# EAGLE design UMN_HASP_2015_Photon_Preprocessor (EAGLE 7.3.0)

## Sheet 1 of 5: ATmega2560
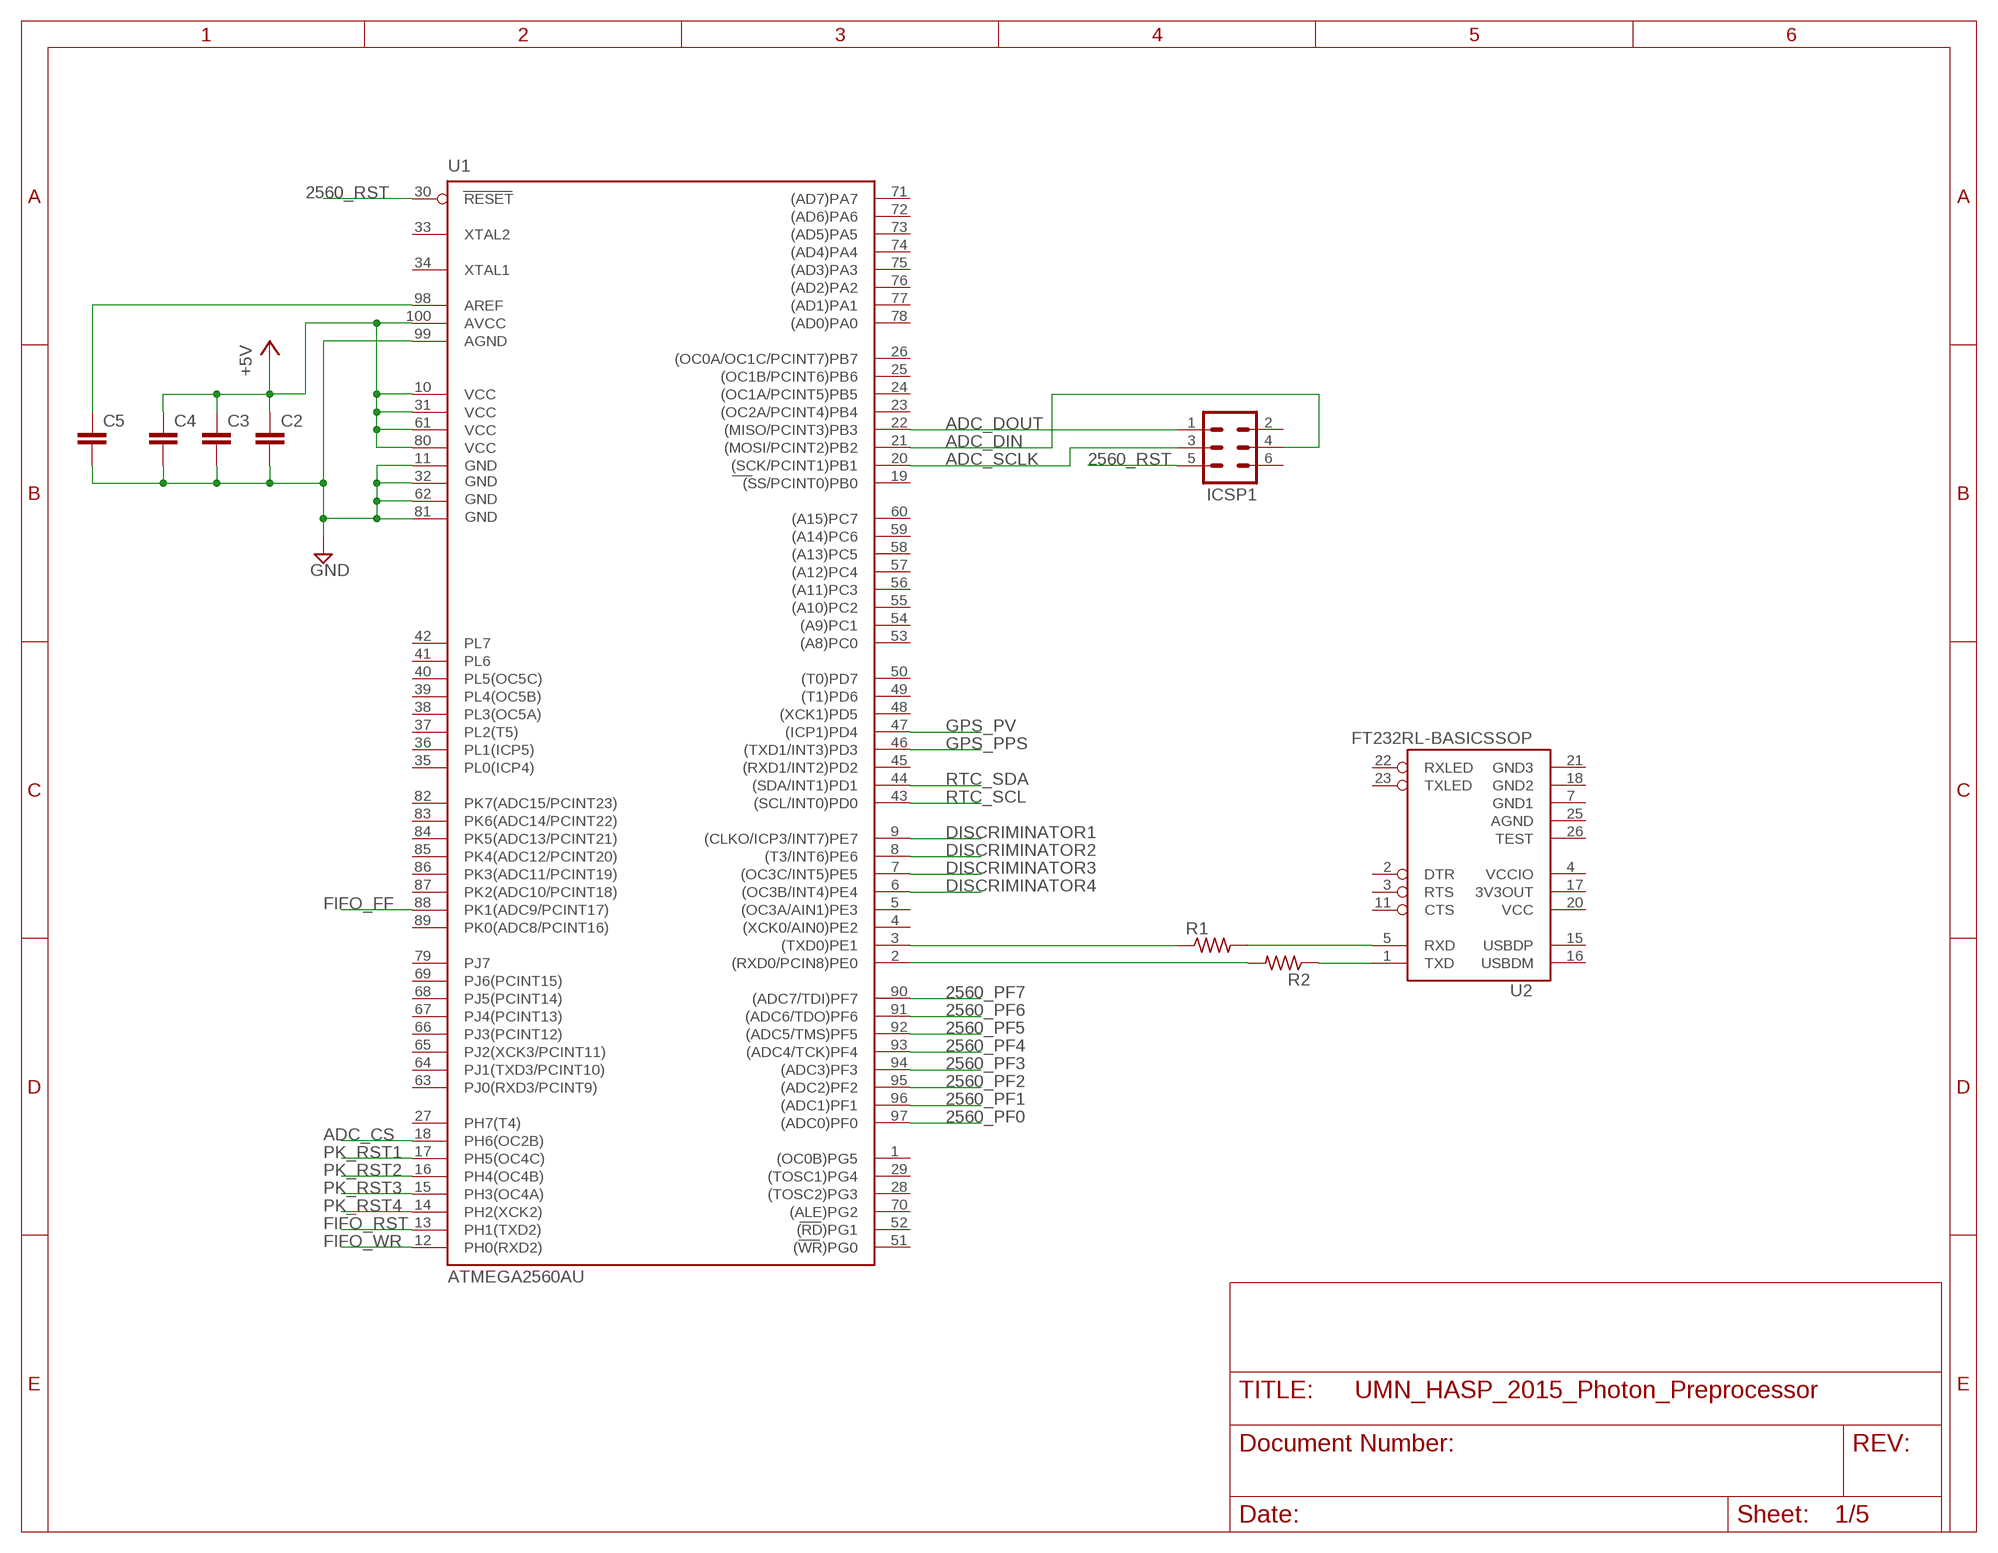
[diagram p0: schematic, sheet 1]

### Parts
C2  C-EUC0603K  [C0603K]
C3  C-EUC0603K  [C0603K]
C4  C-EUC0603K  [C0603K]
C5  C-EUC0603K  [C0603K]
ICSP1  MA03-2  [MA03-2]
R1  R-US_R0603  [R0603]
R2  R-US_R0603  [R0603]
U1  ATMEGA2560AU  [TQFP100]
U2  FT232RL-BASICSSOP  [SSOP28DB]

### Nets
2560_PF0: U1.97((ADC0)PF0) ; also sheet 4
2560_PF1: U1.96((ADC1)PF1) ; also sheet 4
2560_PF2: U1.95((ADC2)PF2) ; also sheet 4
2560_PF3: U1.94((ADC3)PF3) ; also sheet 4
2560_PF4: U1.93((ADC4/TCK)PF4) ; also sheet 4
2560_PF5: U1.92((ADC5/TMS)PF5) ; also sheet 4
2560_PF6: U1.91((ADC6/TDO)PF6) ; also sheet 4
2560_PF7: U1.90((ADC7/TDI)PF7) ; also sheet 4
2560_RST: ICSP1.5 U1.30(RESET)
+5V: C2.1 C3.1 C4.1 U1.10(VCC) U1.31(VCC1) U1.61(VCC2) U1.80(VCC3) U1.100(AVCC) ; also sheet 3,4,5
ADC_CS: U1.18(PH6(OC2B)) ; also sheet 5
ADC_DIN: ICSP1.4 U1.21((MOSI/PCINT2)PB2) ; also sheet 5
ADC_DOUT: ICSP1.1 U1.22((MISO/PCINT3)PB3) ; also sheet 5
ADC_SCLK: ICSP1.3 U1.20((SCK/PCINT1)PB1) ; also sheet 5
DISCRIMINATOR1: U1.9((CLKO/ICP3/INT7)PE7) ; also sheet 5
DISCRIMINATOR2: U1.8((T3/INT6)PE6) ; also sheet 5
DISCRIMINATOR3: U1.7((OC3C/INT5)PE5) ; also sheet 5
DISCRIMINATOR4: U1.6((OC3B/INT4)PE4) ; also sheet 5
FIFO_FF: U1.88(PK1(ADC9/PCINT17)) ; also sheet 4
FIFO_RST: U1.13(PH1(TXD2)) ; also sheet 4
FIFO_WR: U1.12(PH0(RXD2)) ; also sheet 4
GND: C2.2 C3.2 C4.2 C5.2 U1.11(GND) U1.32(GND1) U1.62(GND2) U1.81(GND3) U1.99(AGND) ; also sheet 3,4,5
GPS_PPS: U1.46((TXD1/INT3)PD3) ; also sheet 3
GPS_PV: U1.47((ICP1)PD4) ; also sheet 3
N$8: R2.1 U2.1(TXD)
N$9: R1.2 U2.5(RXD)
N$16: C5.1 U1.98(AREF)
N$18: R2.2 U1.2((RXD0/PCIN8)PE0)
N$19: R1.1 U1.3((TXD0)PE1)
PK_RST1: U1.17(PH5(OC4C)) ; also sheet 5
PK_RST2: U1.16(PH4(OC4B)) ; also sheet 5
PK_RST3: U1.15(PH3(OC4A)) ; also sheet 5
PK_RST4: U1.14(PH2(XCK2)) ; also sheet 5
RTC_SCL: U1.43((SCL/INT0)PD0) ; also sheet 3
RTC_SDA: U1.44((SDA/INT1)PD1) ; also sheet 3
Unconnected: ICSP1.2 ICSP1.6 U1.1((OC0B)PG5) U1.4((XCK0/AIN0)PE2) U1.5((OC3A/AIN1)PE3) U1.19((SS/PCINT0)PB0) U1.23((OC2A/PCINT4)PB4) U1.24((OC1A/PCINT5)PB5) U1.25((OC1B/PCINT6)PB6) U1.26((OC0A/OC1C/PCINT7)PB7) U1.27(PH7(T4)) U1.28((TOSC2)PG3) U1.29((TOSC1)PG4) U1.33(XTAL2) U1.34(XTAL1) U1.35(PL0(ICP4)) U1.36(PL1(ICP5)) U1.37(PL2(T5)) U1.38(PL3(OC5A)) U1.39(PL4(OC5B)) U1.40(PL5(OC5C)) U1.41(PL6) U1.42(PL7) U1.45((RXD1/INT2)PD2) U1.48((XCK1)PD5) U1.49((T1)PD6) U1.50((T0)PD7) U1.51((WR)PG0) U1.52((RD)PG1) U1.53((A8)PC0) U1.54((A9)PC1) U1.55((A10)PC2) U1.56((A11)PC3) U1.57((A12)PC4) U1.58((A13)PC5) U1.59((A14)PC6) U1.60((A15)PC7) U1.63(PJ0(RXD3/PCINT9)) U1.64(PJ1(TXD3/PCINT10)) U1.65(PJ2(XCK3/PCINT11)) U1.66(PJ3(PCINT12)) U1.67(PJ4(PCINT13)) U1.68(PJ5(PCINT14)) U1.69(PJ6(PCINT15)) U1.70((ALE)PG2) U1.71((AD7)PA7) U1.72((AD6)PA6) U1.73((AD5)PA5) U1.74((AD4)PA4) U1.75((AD3)PA3) U1.76((AD2)PA2) U1.77((AD1)PA1) U1.78((AD0)PA0) U1.79(PJ7) U1.82(PK7(ADC15/PCINT23)) U1.83(PK6(ADC14/PCINT22)) U1.84(PK5(ADC13/PCINT21)) U1.85(PK4(ADC12/PCINT20)) U1.86(PK3(ADC11/PCINT19)) U1.87(PK2(ADC10/PCINT18)) U1.89(PK0(ADC8/PCINT16)) U2.2(DTR) U2.3(RTS) U2.11(CTS) U2.15(USBDP) U2.16(USBDM) U2.17(3V3OUT) U2.22(RXLED) U2.23(TXLED) U2.26(TEST)

## Sheet 2 of 5: ATmega32u4
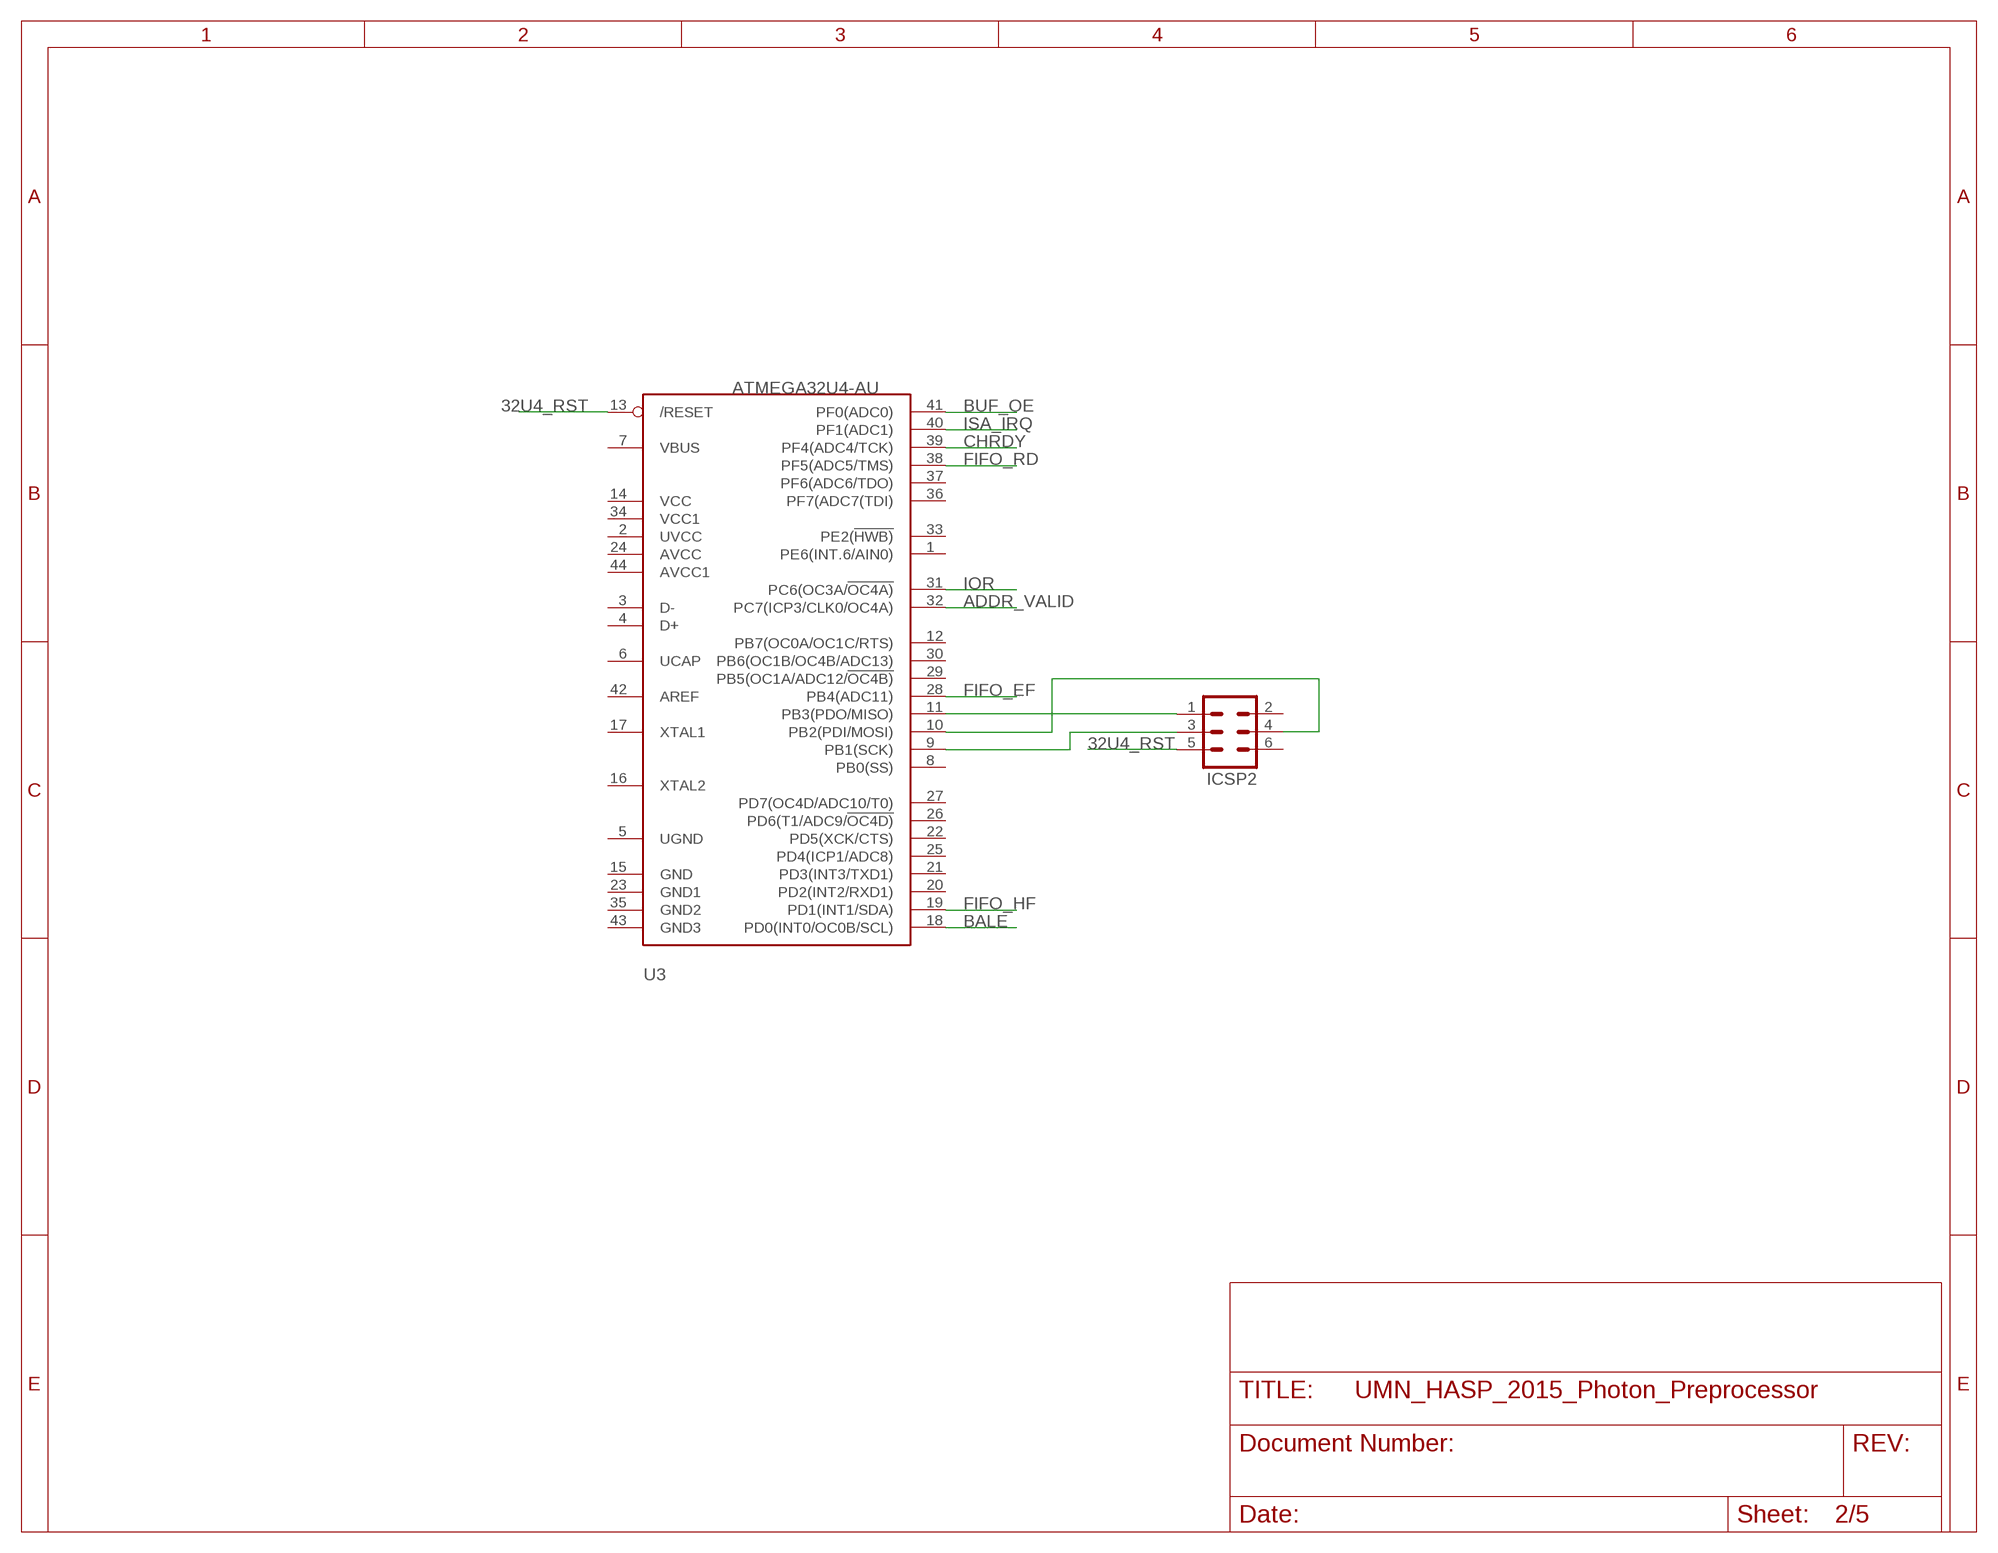
[diagram p1: schematic, sheet 2]

### Parts
ICSP2  MA03-2  [MA03-2]
U3  ATMEGA32U4-AU  [TQFP44]

### Nets
32U4_RST: ICSP2.5 U3.13(/RESET)
ADDR_VALID: U3.32(PC7(ICP3/CLK0/OC4A)) ; also sheet 4
BALE: U3.18(PD0(INT0/OC0B/SCL)) ; also sheet 5
BUF_OE: U3.41(PF0(ADC0)) ; also sheet 4
CHRDY: U3.39(PF4(ADC4/TCK)) ; also sheet 4
FIFO_EF: U3.28(PB4(ADC11)) ; also sheet 4
FIFO_HF: U3.19(PD1(INT1/SDA)) ; also sheet 4
FIFO_RD: U3.38(PF5(ADC5/TMS)) ; also sheet 4
IOR: U3.31(PC6(OC3A/!OC4A)) ; also sheet 5
ISA_IRQ: U3.40(PF1(ADC1)) ; also sheet 4
N$10: ICSP2.1 U3.11(PB3(PDO/MISO))
N$15: ICSP2.3 U3.9(PB1(SCK))
N$17: ICSP2.4 U3.10(PB2(PDI/MOSI))
Unconnected: ICSP2.2 ICSP2.6 U3.1(PE6(INT.6/AIN0)) U3.2(UVCC) U3.3(D-) U3.4(D+) U3.5(UGND) U3.6(UCAP) U3.7(VBUS) U3.8(PB0(SS)) U3.12(PB7(OC0A/OC1C/RTS)) U3.14(VCC) U3.15(GND) U3.16(XTAL2) U3.17(XTAL1) U3.20(PD2(INT2/RXD1)) U3.21(PD3(INT3/TXD1)) U3.22(PD5(XCK/CTS)) U3.23(GND1) U3.24(AVCC) U3.25(PD4(ICP1/ADC8)) U3.26(PD6(T1/ADC9/!OC4D)) U3.27(PD7(OC4D/ADC10/T0)) U3.29(PB5(OC1A/ADC12/!OC4B)) U3.30(PB6(OC1B/OC4B/ADC13)) U3.33(PE2(!HWB)) U3.34(VCC1) U3.35(GND2) U3.36(PF7(ADC7(TDI)) U3.37(PF6(ADC6/TDO)) U3.42(AREF) U3.43(GND3) U3.44(AVCC1)

## Sheet 3 of 5: Timing
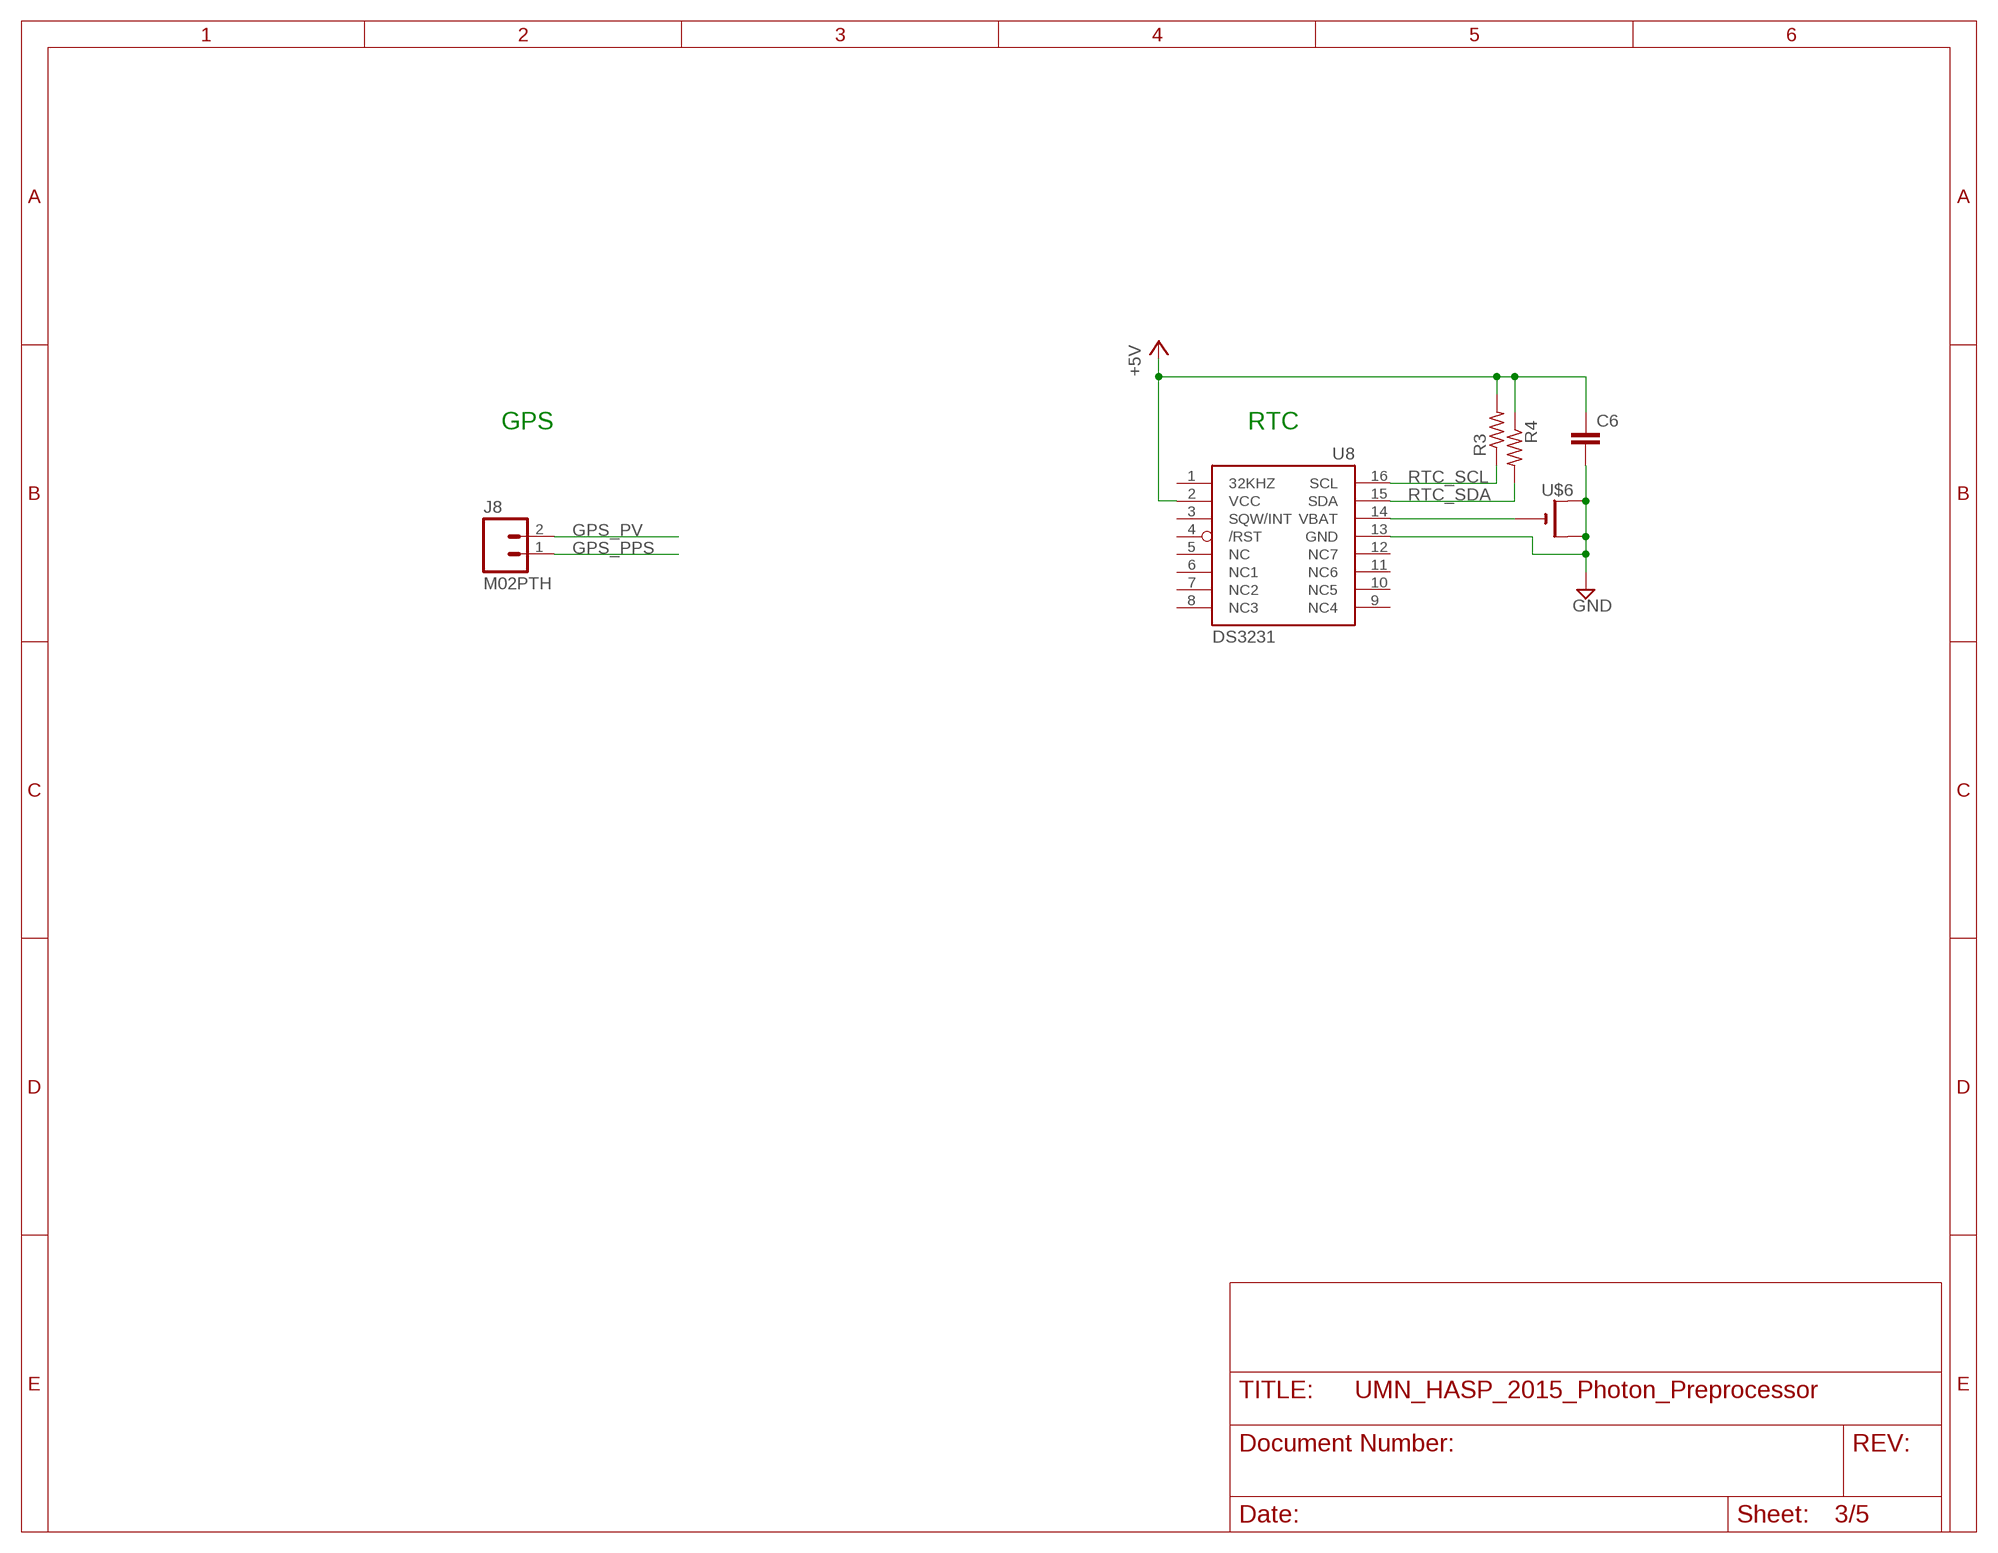
[diagram p2: schematic, sheet 3]

### Parts
C6  C-EUC0603K  [C0603K]
J8  M02PTH  [1X02]
R3  R-US_R0603  [R0603]
R4  R-US_R0603  [R0603]
U8  DS3231/SO  [SO16W]
U$6  CR1220SMT  [CR1220-SMD]

### Nets
+5V: C6.1 R3.2 R4.1 U8.2(VCC) ; also sheet 1,4,5
GND: C6.2 U8.13(GND) U$6.+$1(+) U$6.+$2(+1) ; also sheet 1,4,5
GPS_PPS: J8.1 ; also sheet 1
GPS_PV: J8.2 ; also sheet 1
N$24: U8.14(VBAT) U$6.-
RTC_SCL: R3.1 U8.16(SCL) ; also sheet 1
RTC_SDA: R4.2 U8.15(SDA) ; also sheet 1
Unconnected: U8.1(32KHZ) U8.3(SQW/INT) U8.4(/RST) U8.5(NC) U8.6(NC1) U8.7(NC2) U8.8(NC3) U8.9(NC4) U8.10(NC5) U8.11(NC6) U8.12(NC7)

### Notes on the sheet
- GPS | RTC

## Sheet 4 of 5: Logic
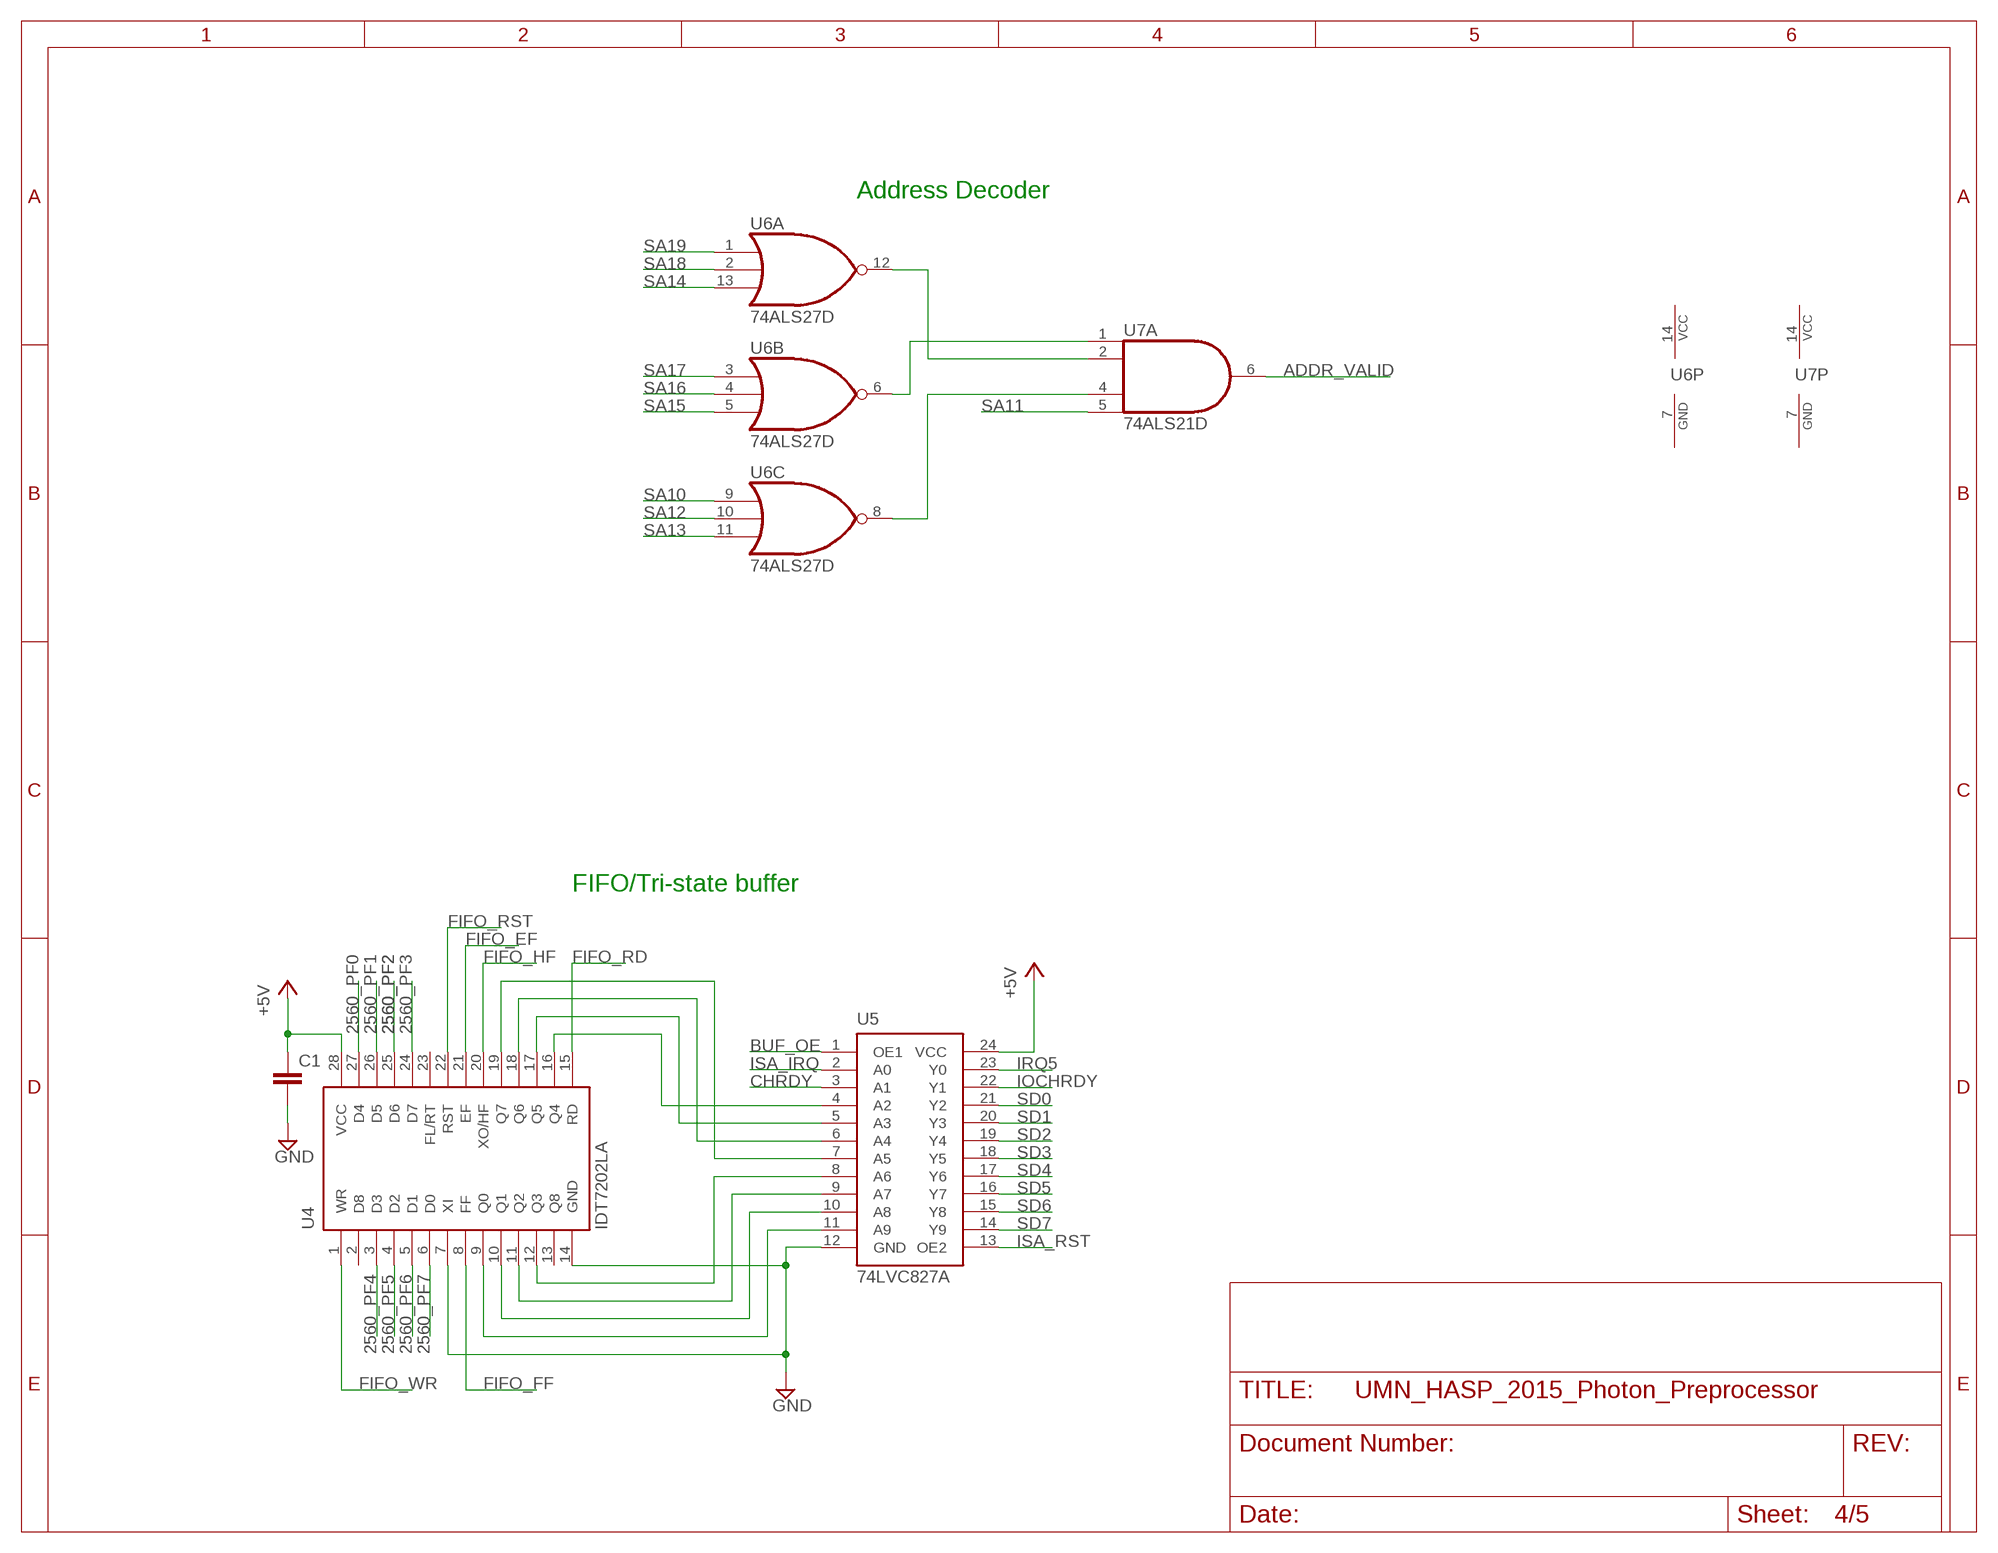
[diagram p3: schematic, sheet 4]

### Parts
C1  C-EUC0603K  [C0603K]
U4  IDT7202LA  [SO28W]
U5  74LVC827A  [SO24W]
U6  74ALS27D  [SO14]
U7  74ALS21D  [SO14]

### Nets
2560_PF0: U4.27(D4) ; also sheet 1
2560_PF1: U4.26(D5) ; also sheet 1
2560_PF2: U4.25(D6) ; also sheet 1
2560_PF3: U4.24(D7) ; also sheet 1
2560_PF4: U4.3(D3) ; also sheet 1
2560_PF5: U4.4(D2) ; also sheet 1
2560_PF6: U4.5(D1) ; also sheet 1
2560_PF7: U4.6(D0) ; also sheet 1
+5V: C1.1 U4.28(VCC) U5.24(VCC) ; also sheet 1,3,5
ADDR_VALID: U7.6(A:O) ; also sheet 2
BUF_OE: U5.1(OE1) ; also sheet 2
CHRDY: U5.3(A1) ; also sheet 2
FIFO_EF: U4.21(EF) ; also sheet 2
FIFO_FF: U4.8(FF) ; also sheet 1
FIFO_HF: U4.20(XO/HF) ; also sheet 2
FIFO_RD: U4.15(RD) ; also sheet 2
FIFO_RST: U4.22(RST) ; also sheet 1
FIFO_WR: U4.1(WR) ; also sheet 1
GND: C1.2 U4.7(XI) U4.14(GND) U5.12(GND) ; also sheet 1,3,5
IOCHRDY: U5.22(Y1) ; also sheet 5
IRQ5: U5.23(Y0) ; also sheet 5
ISA_IRQ: U5.2(A0) ; also sheet 2
ISA_RST: U5.13(OE2) ; also sheet 5
N$1: U6.12(A:O) U7.2(A:I1)
N$2: U6.6(B:O) U7.1(A:I0)
N$3: U6.8(C:O) U7.4(A:I2)
N$4: U4.12(Q3) U5.8(A6)
N$5: U4.11(Q2) U5.9(A7)
N$6: U4.10(Q1) U5.10(A8)
N$7: U4.9(Q0) U5.11(A9)
N$11: U4.16(Q4) U5.4(A2)
N$12: U4.19(Q7) U5.7(A5)
N$13: U4.18(Q6) U5.6(A4)
N$14: U4.17(Q5) U5.5(A3)
SA10: U6.9(C:I0) ; also sheet 5
SA11: U7.5(A:I3) ; also sheet 5
SA12: U6.10(C:I1) ; also sheet 5
SA13: U6.11(C:I2) ; also sheet 5
SA14: U6.13(A:I2) ; also sheet 5
SA15: U6.5(B:I2) ; also sheet 5
SA16: U6.4(B:I1) ; also sheet 5
SA17: U6.3(B:I0) ; also sheet 5
SA18: U6.2(A:I1) ; also sheet 5
SA19: U6.1(A:I0) ; also sheet 5
SD0: U5.21(Y2) ; also sheet 5
SD1: U5.20(Y3) ; also sheet 5
SD2: U5.19(Y4) ; also sheet 5
SD3: U5.18(Y5) ; also sheet 5
SD4: U5.17(Y6) ; also sheet 5
SD5: U5.16(Y7) ; also sheet 5
SD6: U5.15(Y8) ; also sheet 5
SD7: U5.14(Y9) ; also sheet 5
Unconnected: U4.2(D8) U4.13(Q8) U4.23(FL/RT) U7.8(B:O) U7.9(B:I0) U7.10(B:I1) U7.12(B:I2) U7.13(B:I3)

### Notes on the sheet
- Address Decoder
- FIFO/Tri-state buffer

## Sheet 5 of 5: PC/104
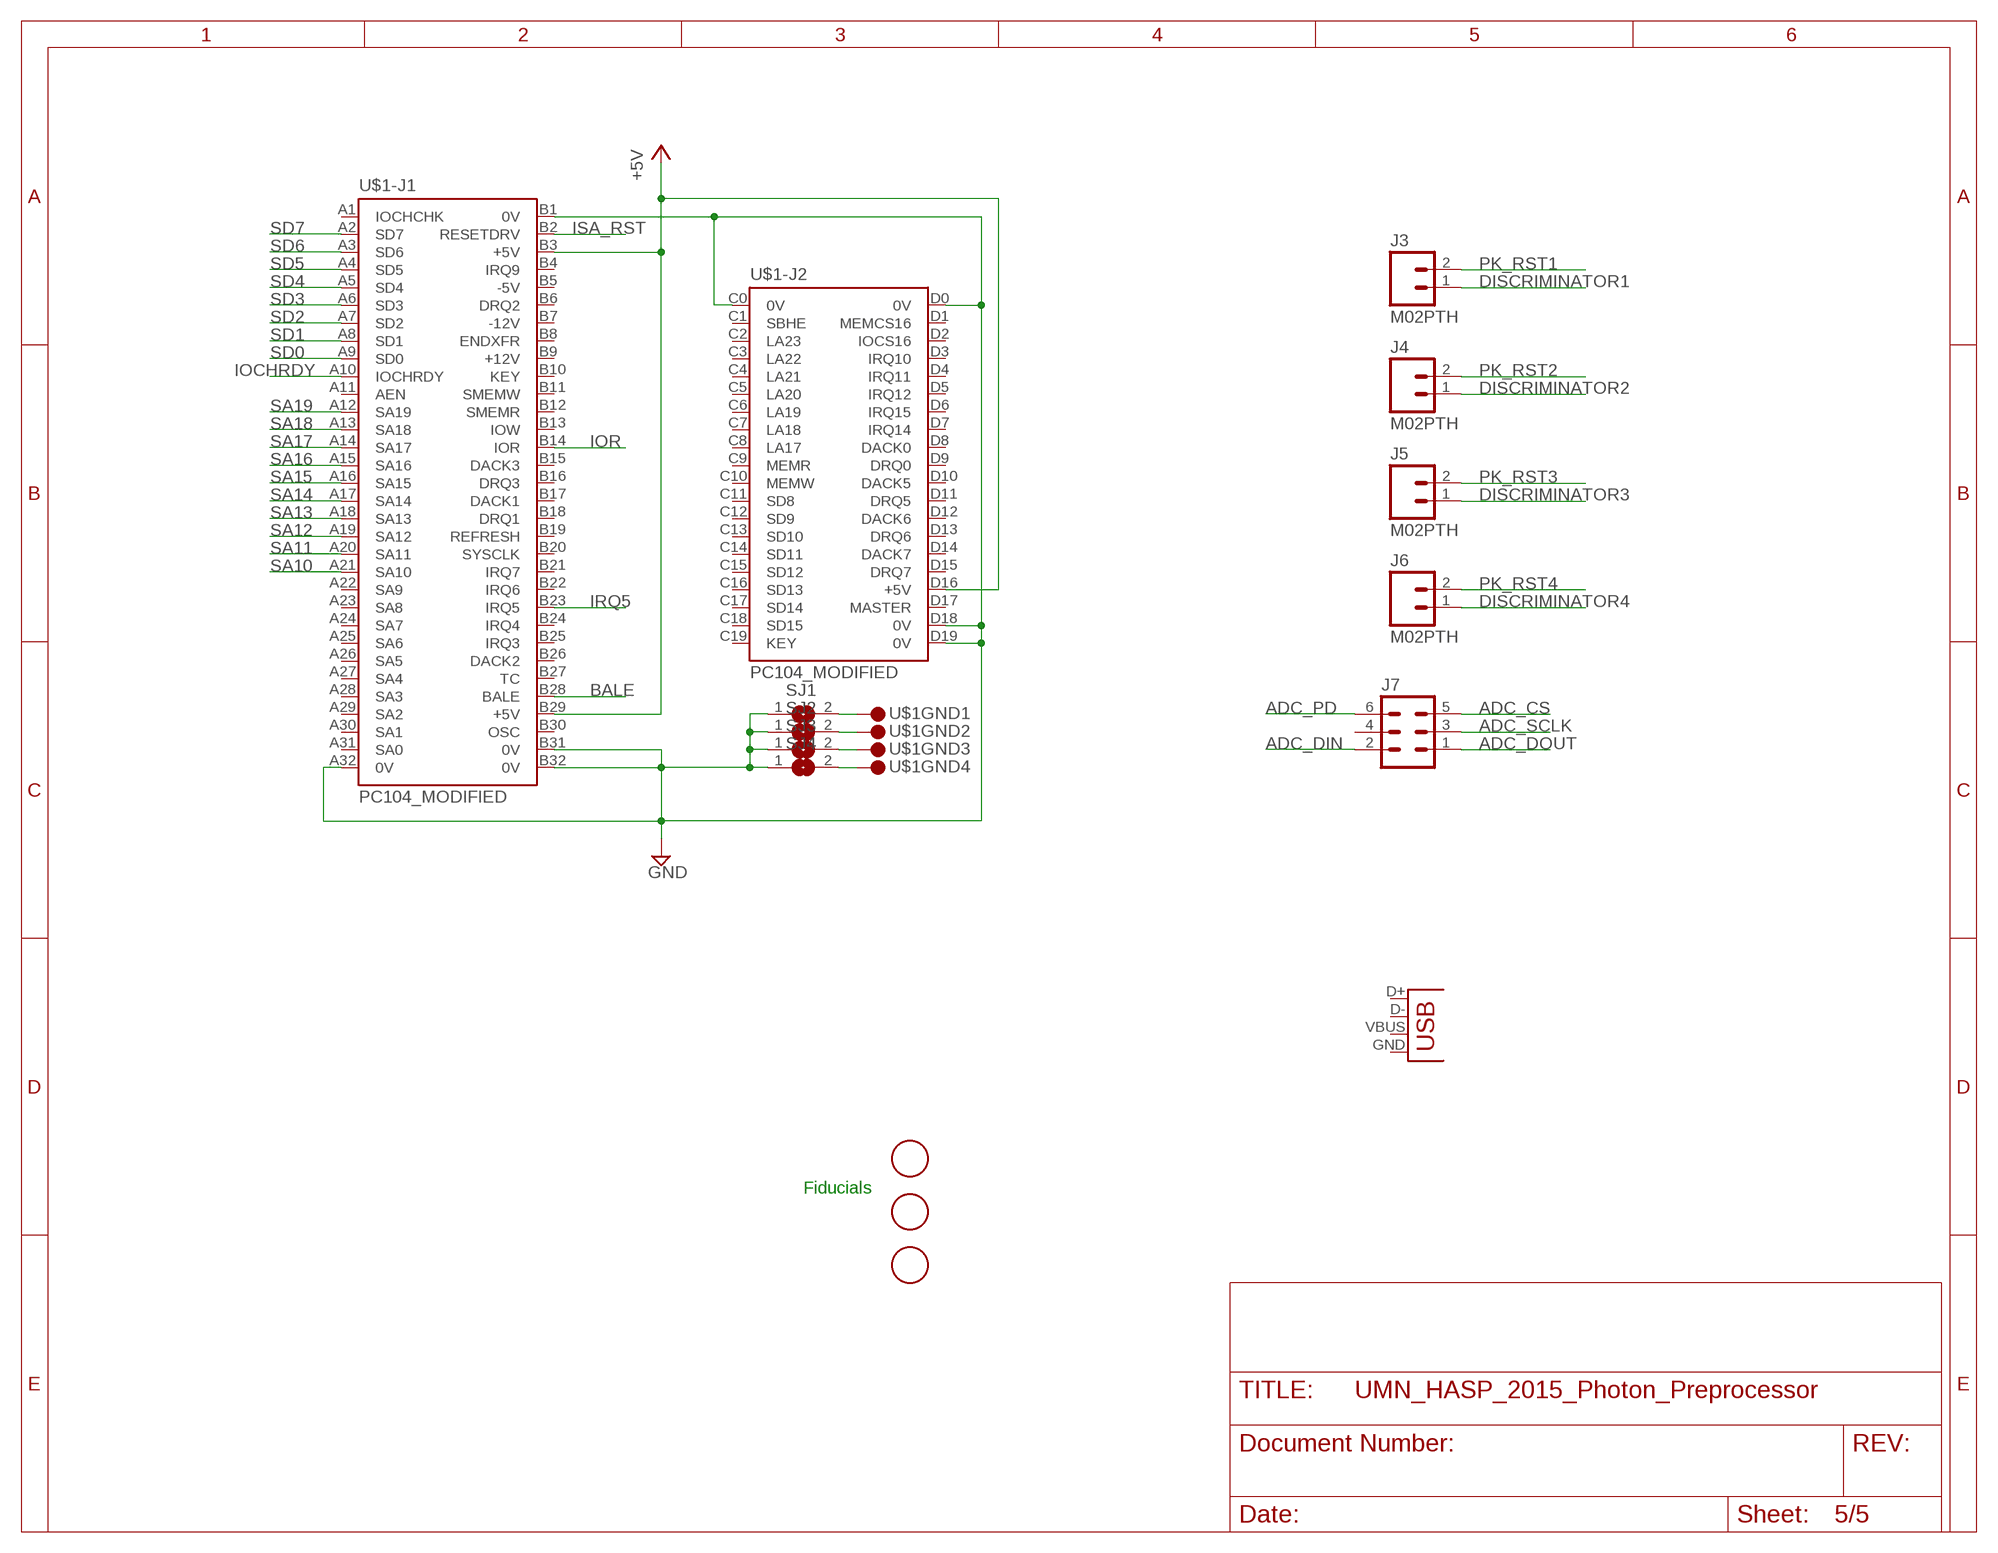
[diagram p4: schematic, sheet 5]

### Parts
J3  M02PTH  [1X02]
J4  M02PTH  [1X02]
J5  M02PTH  [1X02]
J6  M02PTH  [1X02]
J7  MA03-2  [MA03-2]
JP5  USB-B  USBPTH  [USB-B-PTH]
SJ1  SJ  [SJ]
SJ2  SJ  [SJ]
SJ3  SJ  [SJ]
SJ4  SJ  [SJ]
U$1  PC104_MODIFIED  [PC104_MODIFIED]
U$2  FIDUCIAL  [FIDUCIAL_1MM]
U$3  FIDUCIAL  [FIDUCIAL_1MM]
U$4  FIDUCIAL  [FIDUCIAL_1MM]

### Nets
+5V: U$1.B3(-J1:+5V) U$1.B29(-J1:+5V) U$1.D16(-J2:+5V) ; also sheet 1,3,4
ADC_CS: J7.5 ; also sheet 1
ADC_DIN: J7.2 ; also sheet 1
ADC_DOUT: J7.1 ; also sheet 1
ADC_PD: J7.6
ADC_SCLK: J7.3 ; also sheet 1
BALE: U$1.B28(-J1:BALE) ; also sheet 2
DISCRIMINATOR1: J3.1 ; also sheet 1
DISCRIMINATOR2: J4.1 ; also sheet 1
DISCRIMINATOR3: J5.1 ; also sheet 1
DISCRIMINATOR4: J6.1 ; also sheet 1
GND: SJ1.1 SJ2.1 SJ3.1 SJ4.1 U$1.A32(-J1:0V) U$1.B1(-J1:0V) U$1.B31(-J1:0V) U$1.B32(-J1:0V) U$1.C0(-J2:0V) U$1.D0(-J2:0V) U$1.D18(-J2:0V) U$1.D19(-J2:0V) ; also sheet 1,3,4
IOCHRDY: U$1.A10(-J1:IOCHRDY) ; also sheet 4
IOR: U$1.B14(-J1:IOR) ; also sheet 2
IRQ5: U$1.B23(-J1:IRQ5) ; also sheet 4
ISA_RST: U$1.B2(-J1:RESETDRV) ; also sheet 4
N$20: SJ1.2 U$1.GND@1
N$21: SJ2.2 U$1.GND@2
N$22: SJ3.2 U$1.GND@3
N$23: SJ4.2 U$1.GND@4
PK_RST1: J3.2 ; also sheet 1
PK_RST2: J4.2 ; also sheet 1
PK_RST3: J5.2 ; also sheet 1
PK_RST4: J6.2 ; also sheet 1
SA10: U$1.A21(-J1:SA10) ; also sheet 4
SA11: U$1.A20(-J1:SA11) ; also sheet 4
SA12: U$1.A19(-J1:SA12) ; also sheet 4
SA13: U$1.A18(-J1:SA13) ; also sheet 4
SA14: U$1.A17(-J1:SA14) ; also sheet 4
SA15: U$1.A16(-J1:SA15) ; also sheet 4
SA16: U$1.A15(-J1:SA16) ; also sheet 4
SA17: U$1.A14(-J1:SA17) ; also sheet 4
SA18: U$1.A13(-J1:SA18) ; also sheet 4
SA19: U$1.A12(-J1:SA19) ; also sheet 4
SD0: U$1.A9(-J1:SD0) ; also sheet 4
SD1: U$1.A8(-J1:SD1) ; also sheet 4
SD2: U$1.A7(-J1:SD2) ; also sheet 4
SD3: U$1.A6(-J1:SD3) ; also sheet 4
SD4: U$1.A5(-J1:SD4) ; also sheet 4
SD5: U$1.A4(-J1:SD5) ; also sheet 4
SD6: U$1.A3(-J1:SD6) ; also sheet 4
SD7: U$1.A2(-J1:SD7) ; also sheet 4
Unconnected: J7.4 JP5.D+ JP5.D- JP5.GND JP5.VBUS U$1.A1(-J1:IOCHCHK) U$1.A11(-J1:AEN) U$1.A22(-J1:SA9) U$1.A23(-J1:SA8) U$1.A24(-J1:SA7) U$1.A25(-J1:SA6) U$1.A26(-J1:SA5) U$1.A27(-J1:SA4) U$1.A28(-J1:SA3) U$1.A29(-J1:SA2) U$1.A30(-J1:SA1) U$1.A31(-J1:SA0) U$1.B4(-J1:IRQ9) U$1.B5(-J1:-5V) U$1.B6(-J1:DRQ2) U$1.B7(-J1:-12V) U$1.B8(-J1:ENDXFR) U$1.B9(-J1:+12V) U$1.B10(-J1:KEY) U$1.B11(-J1:SMEMW) U$1.B12(-J1:SMEMR) U$1.B13(-J1:IOW) U$1.B15(-J1:DACK3) U$1.B16(-J1:DRQ3) U$1.B17(-J1:DACK1) U$1.B18(-J1:DRQ1) U$1.B19(-J1:REFRESH) U$1.B20(-J1:SYSCLK) U$1.B21(-J1:IRQ7) U$1.B22(-J1:IRQ6) U$1.B24(-J1:IRQ4) U$1.B25(-J1:IRQ3) U$1.B26(-J1:DACK2) U$1.B27(-J1:TC) U$1.B30(-J1:OSC) U$1.C1(-J2:SBHE) U$1.C2(-J2:LA23) U$1.C3(-J2:LA22) U$1.C4(-J2:LA21) U$1.C5(-J2:LA20) U$1.C6(-J2:LA19) U$1.C7(-J2:LA18) U$1.C8(-J2:LA17) U$1.C9(-J2:MEMR) U$1.C10(-J2:MEMW) U$1.C11(-J2:SD8) U$1.C12(-J2:SD9) U$1.C13(-J2:SD10) U$1.C14(-J2:SD11) U$1.C15(-J2:SD12) U$1.C16(-J2:SD13) U$1.C17(-J2:SD14) U$1.C18(-J2:SD15) U$1.C19(-J2:KEY) U$1.D1(-J2:MEMCS16) U$1.D2(-J2:IOCS16) U$1.D3(-J2:IRQ10) U$1.D4(-J2:IRQ11) U$1.D5(-J2:IRQ12) U$1.D6(-J2:IRQ15) U$1.D7(-J2:IRQ14) U$1.D8(-J2:DACK0) U$1.D9(-J2:DRQ0) U$1.D10(-J2:DACK5) U$1.D11(-J2:DRQ5) U$1.D12(-J2:DACK6) U$1.D13(-J2:DRQ6) U$1.D14(-J2:DACK7) U$1.D15(-J2:DRQ7) U$1.D17(-J2:MASTER)

### Notes on the sheet
- Fiducials

## Power pins joined to a net without a drawn wire
AGND: U2.25(AGND)
GND: U6.7(P:GND) U7.7(P:GND)
GND1: U2.7(GND1)
GND2: U2.18(GND2)
GND3: U2.21(GND3)
VCC: U2.20(VCC) U6.14(P:VCC) U7.14(P:VCC)
VCCIO: U2.4(VCCIO)

## Library data of the parts
C1-C6 = resistor:C-EU: CAPACITOR, European symbol
ICSP1 ICSP2 J7 = con-lstb:MA03-2: PIN HEADER; OC_FARNELL: unknown; OC_NEWARK: unknown
J3-J6 J8 = SparkFun-Connectors:M02: Standard 2-pin 0.1" header. Use with - straight break away headers ( PRT-00116) - right angle break away headers (PRT-00553) - swiss pins (PRT-00743) - machine pins (PRT-00117) - female headers (PRT-00115) Molex polarized connector foot print use with: PRT-08233 with associated crimp pins and housings. 2.54_SCREWTERM for use with PRT-10571. 3.5mm Screw Terminal footprints for PRT-08084 5mm Screw Terminal footprints for use with PRT-08433
JP5 = SparkFun-Connectors:USB: USB Connectors USB-B-PTH is fully proven SKU : PRT-00139/CONN-08278 USB-miniB is fully proven SKU : PRT-00587 USB-A-PCB is untested. USB-A-H is throughly reviewed, but untested. Spark Fun Electronics SKU : PRT-00437 USB-B-SMT is throughly reviewed, but untested. Needs silkscreen touching up. USB-A-S has not been used/tested USB-MB-H has not been used/tested USB-MICROB has been used. CONN-09505; PROD_ID: CONN-08278
R1-R4 = resistor:R-US_: RESISTOR, American symbol
SJ1-SJ4 = jumper:SJ: SMD solder JUMPER
U1 = SparkFun-DigitalIC:ATMEGA2560: Atmel 100-pin 8-bit uC 64/128/256 Kbytes FLASH 4 Kbytes EEPROM 8 Kbytes SRAM 86 General Purpose I/O pins 12-channels16-bit PWM 4 x Serial USARTs 16-channels 10-bit A/D
U2 = SparkFun-DigitalIC:FT232RL-BASIC: USB UART This is the simplified version of the FT232RL unit. Only what you need, nothing you don't. Spark Fun Electronics SKU : COM-00650
U3 = adafruit:ATMEGA32U4: http://www.ladyada.net/library/eagle
U4 = HAXDT_CUSTOM:IDT7202LA: IDT 1k x 9 asynchronous FIFO
U5 = HAXDT_CUSTOM:74LVC827A: NXP 10-bit tri-state buffer/line driver
U6 = 74xx-us:74*27: Triple 3-input NOR gate
U7 = 74xx-us:74*21: Dual 4-input AND gate
U8 = adafruit:DS3231
U$1 = con-pc104:PC104_MODIFIED
U$2-U$4 = adafruit:FIDUCIAL: For use by pick and place machines to calibrate the vision/machine, 1mm By microbuilder.eu
U$6 = adafruit:CR1220: CR1216/CR1220/CR1225 12mm 3V lithium coin cell Great for battery packup. Both SMT and THM holders. Note the THM package has the ground pads on both sides of the PCB so that the masks are the same - this reduces the cost

## Board
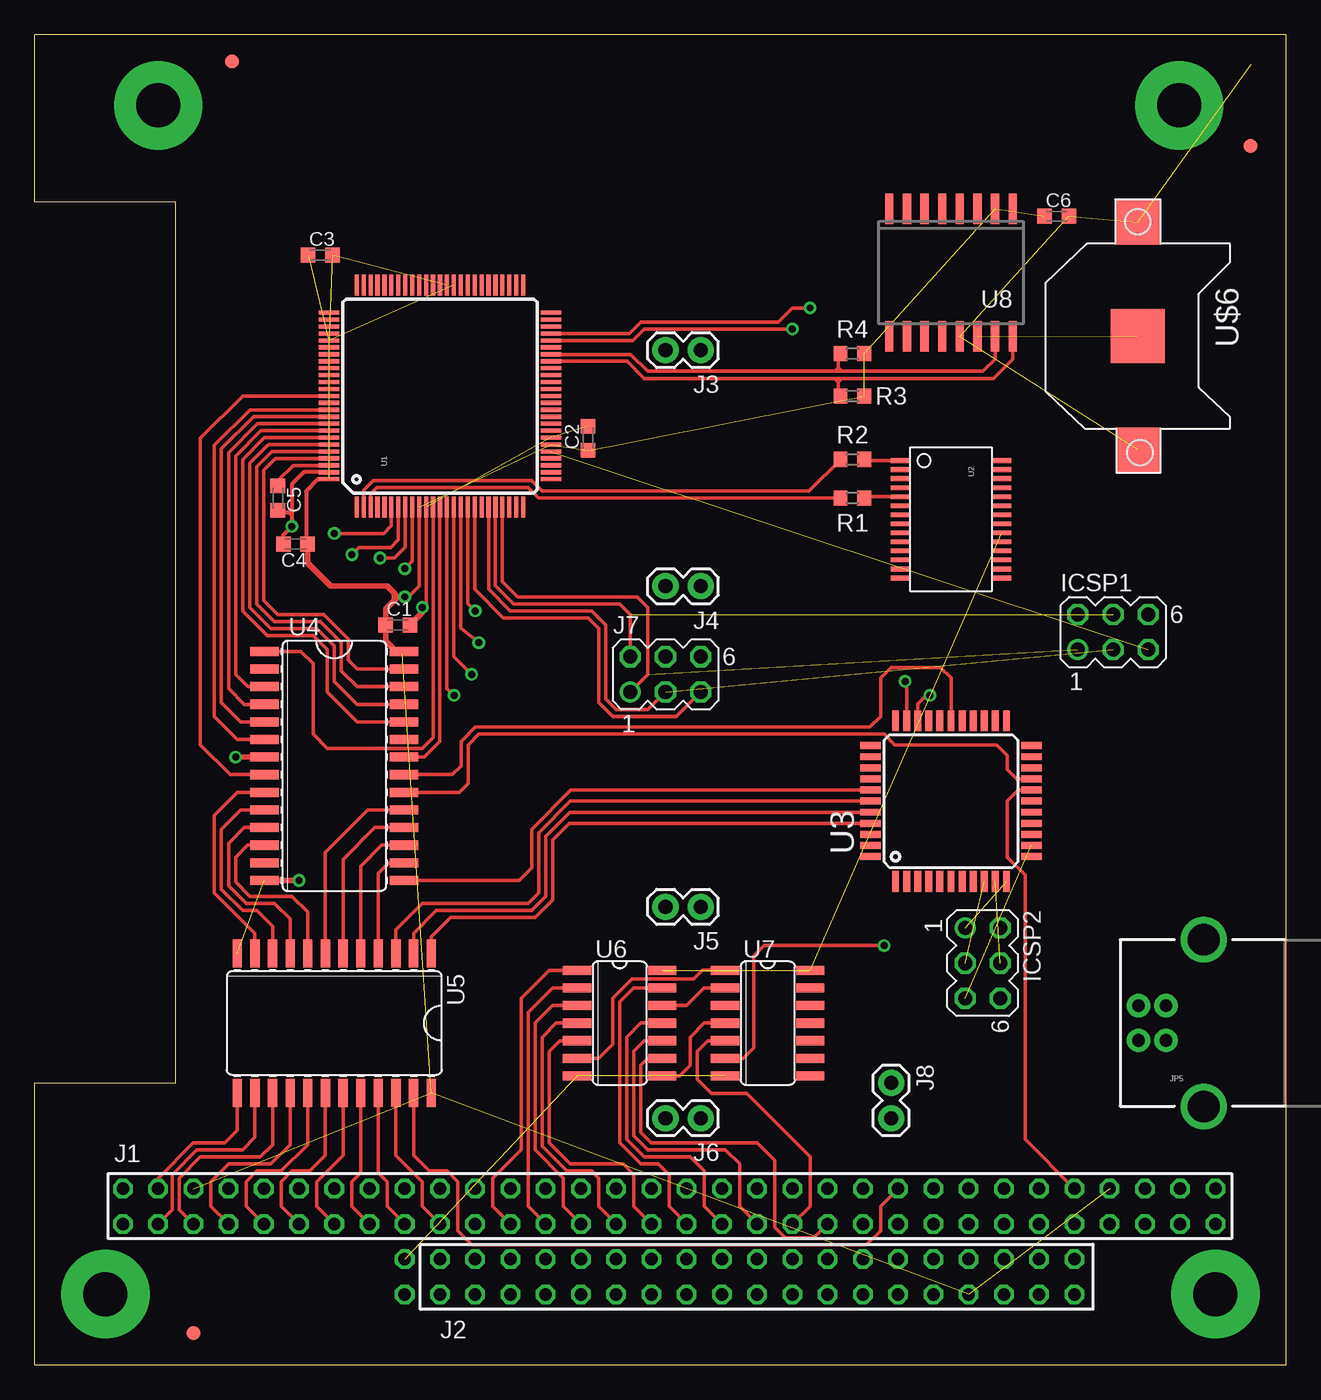
[diagram p5: board, top side]
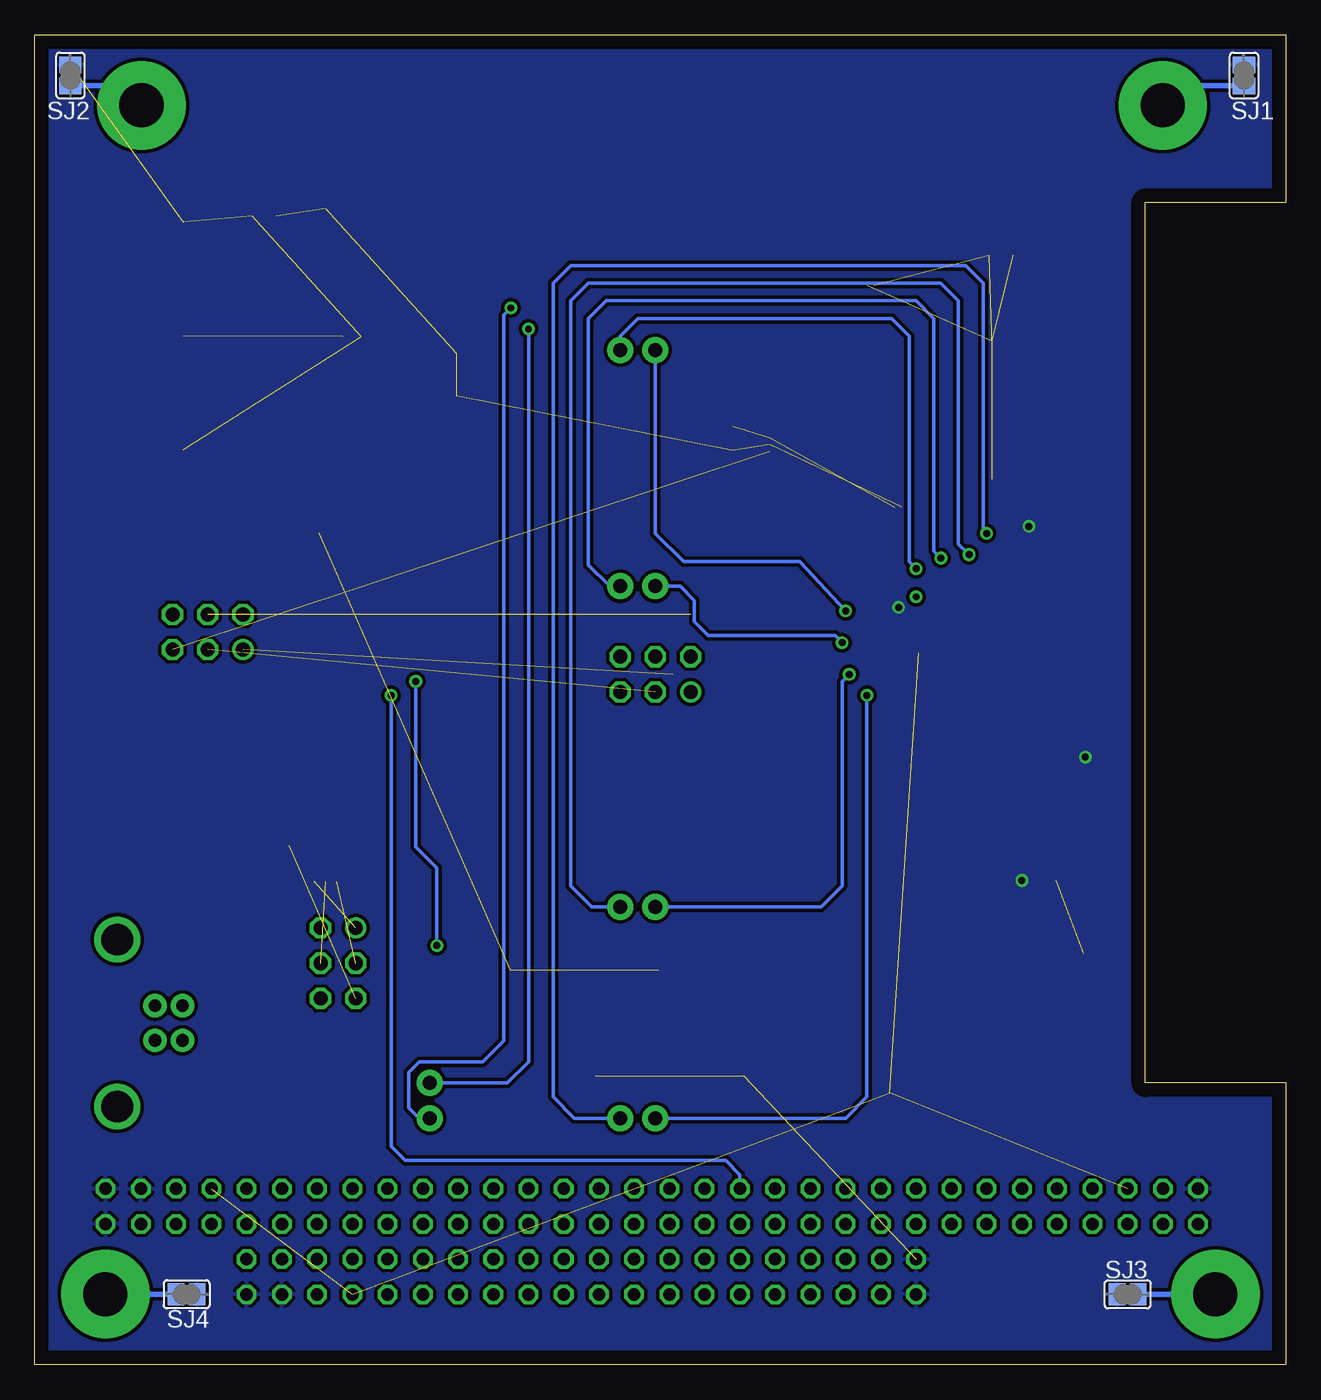
[diagram p6: board, bottom side, seen from below]

Size 90.2 x 95.9 mm. Coordinates in mm from the lower left corner, seen from the top.
Copper layers (1*16): Top 0.035mm / dielectric 1.5mm / Bottom 0.035mm
Design rules "default": minimum track width 10mil, minimum drill 24mil, track to track 8mil, track to pad 8mil, pad to pad 8mil, via to via 8mil, smd to smd 8mil, copper to edge 40mil, drill to drill 8mil, minimum pad ring 10mil, minimum via ring 8mil, stop-mask expansion 4mil, vias tented up to drill 0mil, thermal gap 10mil

### Footprints (pad centres in the part's own frame; a part is rotated, then mirrored left to right if it is on the bottom)
C0603K = smd 1.05 x 1.08: 1 -0.875,0; 2 0.875,0
MA03-2 = drill 1.016: 1 -2.54,-1.27 | drill 1.016 octagon: 2 -2.54,1.27; 3 0,-1.27; 4 0,1.27; 5 2.54,-1.27; 6 2.54,1.27
1X02 = drill 1.016 pad 1.88: 1 0,0; 2 2.54,0
USB-B-PTH = drill 0.914 pad 1.676: D+ 0,1.25; D- 1.981,1.25; GND 0,-1.25; VBUS 1.981,-1.25 | drill 2.286: S1 -2.718,-6.02; S2 -2.718,6.02
R0603 = smd 1 x 1.1: 1 -0.85,0; 2 0.85,0
SJ = smd 1.168 x 1.6: 1 -0.762,0; 2 0.762,0
TQFP100 = smd 1.5 x 0.3: 1 -8,6; 2 -8,5.5; 3 -8,5; 4 -8,4.5; 5 -8,4; 6 -8,3.5; 7 -8,3; 8 -8,2.5; 9 -8,2; 10 -8,1.5; 11 -8,1; 12 -8,0.5; 13 -8,0; 14 -8,-0.5; 15 -8,-1; 16 -8,-1.5; 17 -8,-2; 18 -8,-2.5; 19 -8,-3; 20 -8,-3.5; 21 -8,-4; 22 -8,-4.5; 23 -8,-5; 24 -8,-5.5; 25 -8,-6; 51 8,-6; 52 8,-5.5; 53 8,-5; 54 8,-4.5; 55 8,-4; 56 8,-3.5; 57 8,-3; 58 8,-2.5; 59 8,-2; 60 8,-1.5; 61 8,-1; 62 8,-0.5; 63 8,0; 64 8,0.5; 65 8,1; 66 8,1.5; 67 8,2; 68 8,2.5; 69 8,3; 70 8,3.5; 71 8,4; 72 8,4.5; 73 8,5; 74 8,5.5; 75 8,6 | smd 0.3 x 1.5: 26 -6,-8; 27 -5.5,-8; 28 -5,-8; 29 -4.5,-8; 30 -4,-8; 31 -3.5,-8; 32 -3,-8; 33 -2.5,-8; 34 -2,-8; 35 -1.5,-8; 36 -1,-8; 37 -0.5,-8; 38 0,-8; 39 0.5,-8; 40 1,-8; 41 1.5,-8; 42 2,-8; 43 2.5,-8; 44 3,-8; 45 3.5,-8; 46 4,-8; 47 4.5,-8; 48 5,-8; 49 5.5,-8; 50 6,-8; 76 6,8; 77 5.5,8; 78 5,8; 79 4.5,8; 80 4,8; 81 3.5,8; 82 3,8; 83 2.5,8; 84 2,8; 85 1.5,8; 86 1,8; 87 0.5,8; 88 0,8; 89 -0.5,8; 90 -1,8; 91 -1.5,8; 92 -2,8; 93 -2.5,8; 94 -3,8; 95 -3.5,8; 96 -4,8; 97 -4.5,8; 98 -5,8; 99 -5.5,8; 100 -6,8
SSOP28DB = smd 0.348 x 1.397: 1 -4.225,-3.656; 2 -3.575,-3.656; 3 -2.925,-3.656; 4 -2.275,-3.656; 5 -1.625,-3.656; 6 -0.975,-3.656; 7 -0.325,-3.656; 8 0.325,-3.656; 9 0.975,-3.656; 10 1.625,-3.656; 11 2.275,-3.656; 12 2.925,-3.656; 13 3.575,-3.656; 14 4.225,-3.656; 15 4.225,3.656; 16 3.575,3.656; 17 2.925,3.656; 18 2.275,3.656; 19 1.625,3.656; 20 0.975,3.656; 21 0.325,3.656; 22 -0.325,3.656; 23 -0.975,3.656; 24 -1.625,3.656; 25 -2.275,3.656; 26 -2.925,3.656; 27 -3.575,3.656; 28 -4.225,3.656
TQFP44 = smd 1.5 x 0.5: 1 -5.8,4; 2 -5.8,3.2; 3 -5.8,2.4; 4 -5.8,1.6; 5 -5.8,0.8; 6 -5.8,0; 7 -5.8,-0.8; 8 -5.8,-1.6; 9 -5.8,-2.4; 10 -5.8,-3.2; 11 -5.8,-4; 23 5.8,-4; 24 5.8,-3.2; 25 5.8,-2.4; 26 5.8,-1.6; 27 5.8,-0.8; 28 5.8,0; 29 5.8,0.8; 30 5.8,1.6; 31 5.8,2.4; 32 5.8,3.2; 33 5.8,4 | smd 0.5 x 1.5: 12 -4,-5.8; 13 -3.2,-5.8; 14 -2.4,-5.8; 15 -1.6,-5.8; 16 -0.8,-5.8; 17 0,-5.8; 18 0.8,-5.8; 19 1.6,-5.8; 20 2.4,-5.8; 21 3.2,-5.8; 22 4,-5.8; 34 4,5.8; 35 3.2,5.8; 36 2.4,5.8; 37 1.6,5.8; 38 0.8,5.8; 39 0,5.8; 40 -0.8,5.8; 41 -1.6,5.8; 42 -2.4,5.8; 43 -3.2,5.8; 44 -4,5.8
SO28W = smd 0.66 x 2.032: 1 -8.255,-5.029; 2 -6.985,-5.029; 3 -5.715,-5.029; 4 -4.445,-5.029; 5 -3.175,-5.029; 6 -1.905,-5.029; 7 -0.635,-5.029; 8 0.635,-5.029; 9 1.905,-5.029; 10 3.175,-5.029; 11 4.445,-5.029; 12 5.715,-5.029; 13 6.985,-5.029; 14 8.255,-5.029; 15 8.255,5.029; 16 6.985,5.029; 17 5.715,5.029; 18 4.445,5.029; 19 3.175,5.029; 20 1.905,5.029; 21 0.635,5.029; 22 -0.635,5.029; 23 -1.905,5.029; 24 -3.175,5.029; 25 -4.445,5.029; 26 -5.715,5.029; 27 -6.985,5.029; 28 -8.255,5.029
SO24W = smd 0.66 x 2.032: 1 -6.985,-5.029; 2 -5.715,-5.029; 3 -4.445,-5.029; 4 -3.175,-5.029; 5 -1.905,-5.029; 6 -0.635,-5.029; 7 0.635,-5.029; 8 1.905,-5.029; 9 3.175,-5.029; 10 4.445,-5.029; 11 5.715,-5.029; 12 6.985,-5.029; 13 6.985,5.029; 14 5.715,5.029; 15 4.445,5.029; 16 3.175,5.029; 17 1.905,5.029; 18 0.635,5.029; 19 -0.635,5.029; 20 -1.905,5.029; 21 -3.175,5.029; 22 -4.445,5.029; 23 -5.715,5.029; 24 -6.985,5.029
SO14 = smd 0.66 x 2.032: 1 -3.81,-3.073; 2 -2.54,-3.073; 3 -1.27,-3.073; 4 0,-3.073; 5 1.27,-3.073; 6 2.54,-3.073; 7 3.81,-3.073; 8 3.81,3.073; 9 2.54,3.073; 10 1.27,3.073; 11 0,3.073; 12 -1.27,3.073; 13 -2.54,3.073; 14 -3.81,3.073
SO16W = smd 0.6 x 2.2: 1 -4.445,-4.6; 2 -3.175,-4.6; 3 -1.905,-4.6; 4 -0.635,-4.6; 5 0.635,-4.6; 6 1.905,-4.6; 7 3.175,-4.6; 8 4.445,-4.6; 9 4.445,4.6; 10 3.175,4.6; 11 1.905,4.6; 12 0.635,4.6; 13 -0.635,4.6; 14 -1.905,4.6; 15 -3.175,4.6; 16 -4.445,4.6
PC104_MODIFIED = drill 0.9 pad 1.397 octagon: A1 6.35,10.16; A2 8.89,10.16; A3 11.43,10.16; A4 13.97,10.16; A5 16.51,10.16; A6 19.05,10.16; A7 21.59,10.16; A8 24.13,10.16; A9 26.67,10.16; A10 29.21,10.16; A11 31.75,10.16; A12 34.29,10.16; A13 36.83,10.16; A14 39.37,10.16; A15 41.91,10.16; A16 44.45,10.16; A17 46.99,10.16; A18 49.53,10.16; A19 52.07,10.16; A20 54.61,10.16; A21 57.15,10.16; A22 59.69,10.16; A23 62.23,10.16; A24 64.77,10.16; A25 67.31,10.16; A26 69.85,10.16; A27 72.39,10.16; A28 74.93,10.16; A29 77.47,10.16; A30 80.01,10.16; A31 82.55,10.16; A32 85.09,10.16; B1 6.35,12.7; B2 8.89,12.7; B3 11.43,12.7; B4 13.97,12.7; B5 16.51,12.7; B6 19.05,12.7; B7 21.59,12.7; B8 24.13,12.7; B9 26.67,12.7; B10 29.21,12.7; B11 31.75,12.7; B12 34.29,12.7; B13 36.83,12.7; B14 39.37,12.7; B15 41.91,12.7; B16 44.45,12.7; B17 46.99,12.7; B18 49.53,12.7; B19 52.07,12.7; B20 54.61,12.7; B21 57.15,12.7; B22 59.69,12.7; B23 62.23,12.7; B24 64.77,12.7; B25 67.31,12.7; B26 69.85,12.7; B27 72.39,12.7; B28 74.93,12.7; B29 77.47,12.7; B30 80.01,12.7; B31 82.55,12.7; B32 85.09,12.7; C0 26.67,7.62; C1 29.21,7.62; C2 31.75,7.62; C3 34.29,7.62; C4 36.83,7.62; C5 39.37,7.62; C6 41.91,7.62; C7 44.45,7.62; C8 46.99,7.62; C9 49.53,7.62; C10 52.07,7.62; C11 54.61,7.62; C12 57.15,7.62; C13 59.69,7.62; C14 62.23,7.62; C15 64.77,7.62; C16 67.31,7.62; C17 69.85,7.62; C18 72.39,7.62; C19 74.93,7.62; D0 26.67,5.08; D1 29.21,5.08; D2 31.75,5.08; D3 34.29,5.08; D4 36.83,5.08; D5 39.37,5.08; D6 41.91,5.08; D7 44.45,5.08; D8 46.99,5.08; D9 49.53,5.08; D10 52.07,5.08; D11 54.61,5.08; D12 57.15,5.08; D13 59.69,5.08; D14 62.23,5.08; D15 64.77,5.08; D16 67.31,5.08; D17 69.85,5.08; D18 72.39,5.08; D19 74.93,5.08 | drill 3.175 pad 6.35: GND@1 8.9,90.8; GND@2 82.5,90.8; GND@3 5.1,5.1; GND@4 85.1,5.1
FIDUCIAL_1MM = smd 1 x 1: 1 0,0
CR1220-SMD = smd 3.2 x 3.2: +$1 -8.2,0; +$2 8.2,0 | smd 3.9 x 3.9: - 0,0

### Placement (x,y rotation side)
C1  26.16,53.34 0 top
C2  39.88,66.8 90 top
C3  20.57,80.01 0 top
C4  18.8,59.18 180 top
C5  17.53,62.48 270 top
C6  73.66,82.8 0 top
ICSP1  77.72,52.83 0 top
ICSP2  68.33,28.96 270 top
J3  48.01,73.15 180 top
J4  48.01,56.13 180 top
J5  48.01,33.02 180 top
J6  48.01,17.78 180 top
J7  45.47,49.78 0 top
J8  61.72,20.32 270 top
JP5  81.53,24.64 180 top
R1  58.93,62.48 0 top
R2  58.93,65.28 180 top
R3  58.93,69.85 0 top
R4  58.93,72.9 180 top
SJ1  3.05,92.96 270 bottom
SJ2  87.63,92.96 270 bottom
SJ3  11.43,5.08 0 bottom
SJ4  79.25,5.08 180 bottom
U1  29.21,69.85 90 top
U2  66.04,60.96 270 top
U3  66.04,40.64 90 top
U4  21.59,43.18 270 top
U5  21.59,24.64 180 top
U6  42.16,24.64 270 top
U7  52.83,24.64 270 top
U8  66.04,78.74 180 top
U$1  0,0 0 top
U$2  11.43,2.29 0 top
U$3  14.22,93.98 0 top
U$4  87.63,87.88 0 top
U$6  79.5,74.17 270 top

### Tracks (layer width: path | path; a pad name or v marks a point on that pad's centre or on a via)
32U4_RST  (1 unrouted)
2560_PF0
  Top 0.254: U4.27 23.24,50.16 22.61,50.8 22.61,52.32 20.83,54.1 17.53,54.1 16.51,55.12 16.51,64.52 17.34,65.35 U1.97
2560_PF1
  Top 0.254: U4.26 23.24,48.9 22.1,50.04 22.1,52.07 20.57,53.59 17.27,53.59 16,54.86 16,64.77 17.08,65.85 U1.96
2560_PF2
  Top 0.254: U4.25 23.24,47.62 21.59,49.28 21.59,51.82 20.32,53.09 17.02,53.09 15.49,54.61 15.49,65.02 16.82,66.35 U1.95
2560_PF3
  Top 0.254: U1.94 16.56,66.85 14.99,65.28 14.99,54.36 16.76,52.58 20.07,52.58 21.08,51.56 21.08,48.51 23.24,46.35 U4.24
2560_PF4
  Top 0.254: U4.3 15.37,48.9 14.48,49.78 14.48,65.53 16.3,67.35 U1.93
2560_PF5
  Top 0.254: U4.4 15.11,47.62 13.97,48.77 13.97,65.79 16.03,67.85 U1.92
2560_PF6
  Top 0.254: U4.5 14.86,46.35 13.46,47.75 13.46,66.04 15.77,68.35 U1.91
2560_PF7
  Top 0.254: U4.6 14.61,45.09 12.95,46.74 12.95,66.29 15.51,68.85 U1.90
2560_RST  (1 unrouted)
+5V  (via drill 0.5)  (13 unrouted)
  Top 0.254: v26.67,55.37 26.92,55.37 27.71,56.16 U1.10
  Top 0.305: U1.100 20.42,63.85 19.56,62.99 19.56,59.3 C4.1
  Top 0.406: 26.53,51.52 U4.28 26.49,51.31 26.16,51.31 25.29,52.18 C1.1 25.29,54.5 25.91,55.12 | 25.91,55.12 26.16,55.37 | v26.67,55.37 26.16,55.37 | 26.16,55.37 25.91,55.63 | 25.91,55.63 25.4,56.13 21.34,56.13 19.67,57.8 C4.1 | 25.91,55.63 25.91,55.12
ADC_CS
  Top 0.254: J7.5 46.23,46.74 41.66,46.74 40.64,47.75 40.64,53.09 39.88,53.85 33.78,53.85 31.71,55.92 U1.18
ADC_DIN  (1 unrouted)
  Top 0.254: U1.21 33.21,56.2 34.54,54.86 42.16,54.86 42.93,54.1 J7.2
ADC_DOUT  (1 unrouted)
  Top 0.254: U1.22 33.71,56.46 34.8,55.37 43.43,55.37 44.2,54.61 44.2,49.78 J7.1
ADC_SCLK  (1 unrouted)
  Top 0.254: J7.3 44.2,47.24 41.91,47.24 41.15,48.01 41.15,53.34 40.13,54.36 34.29,54.36 32.71,55.94 U1.20
ADDR_VALID  (via drill 0.5)
  Top 0.254: U7.6 51.05,22.1 51.82,22.86 51.82,29.46 52.58,30.23 v61.21,30.23 | U3.32 62.84,49.17 v62.74,49.28
  Bottom 0.254: v61.21,30.23 61.21,35.81 62.74,37.34 v62.74,49.28
BALE
  Top 0.254: U3.18 70.9,41.44 70.1,40.64 70.1,36.58 71.37,35.31 71.37,16.26 U$1.B28
BUF_OE
  Top 0.254: U3.41 38.53,39.04 37.34,37.85 37.34,33.53 36.07,32.26 29.97,32.26 28.57,30.86 U5.1
CHRDY
  Top 0.254: U3.39 38.61,40.64 36.32,38.35 36.32,34.04 35.56,33.27 27.94,33.27 26.04,31.37 U5.3
DISCRIMINATOR1  (via drill 0.5)
  Top 0.254: U1.9 27.21,57.94 v26.67,57.4
  Bottom 0.254: J3.1 48.01,74.17 46.74,75.44 28.45,75.44 27.18,74.17 27.18,57.91 v26.67,57.4
DISCRIMINATOR2  (via drill 0.5)
  Top 0.254: U1.8 26.71,58.97 25.91,58.17 v24.89,58.17
  Bottom 0.254: J4.1 48.77,56.13 50.29,57.66 50.29,75.44 49.02,76.71 26.67,76.71 25.4,75.44 25.4,58.67 v24.89,58.17
DISCRIMINATOR3  (via drill 0.5)
  Top 0.254: U1.7 26.21,59.48 25.65,58.93 23.37,58.93 v22.86,58.42
  Bottom 0.254: J5.1 50.04,33.02 51.56,34.54 51.56,76.71 50.29,77.98 24.89,77.98 23.62,76.71 23.62,59.18 v22.86,58.42
DISCRIMINATOR4  (via drill 0.5)
  Top 0.254: U1.6 25.71,60.51 25.15,59.94 v21.59,59.94
  Bottom 0.254: J6.1 51.31,17.78 52.83,19.3 52.83,77.98 51.56,79.25 23.11,79.25 21.84,77.98 21.84,60.2 v21.59,59.94
FIFO_EF
  Top 0.254: U4.21 30.1,42.55 30.73,43.18 30.73,44.96 31.75,45.97 60.2,45.97 60.96,46.74 60.96,49.53 61.72,50.29 65.28,50.29 66.04,49.53 U3.28
FIFO_FF
  Top 0.254: U4.8 14.1,42.55 11.94,44.7 11.94,66.8 14.99,69.85 U1.88
FIFO_HF
  Top 0.254: U4.20 30.61,41.27 31.24,41.91 31.24,44.7 32,45.47 61.21,45.47 61.98,44.7 69.34,44.7 70.1,43.94 70.1,42.93 70.79,42.24 U3.19
FIFO_RD
  Top 0.254: U3.38 38.65,41.44 35.81,38.61 35.81,35.81 34.92,34.92 U4.15
FIFO_RST
  Top 0.254: U4.22 28.07,43.81 29.21,44.96 U1.13
FIFO_WR
  Top 0.254: U4.1 19.18,51.44 20.07,50.55 20.07,45.47 21.08,44.45 27.94,44.45 28.71,45.22 U1.12
GND  (via drill 0.5)  (12 unrouted)
  Top 0.254: U1.11 28.21,54.88 v27.94,54.61 | 18.54,61.72 18.29,61.47 18.54,61.21
  Top 0.305: U1.99 19.39,64.35 18.54,63.5 18.54,61.72 18.54,61.47 | 18.54,61.47 18.54,61.21 v18.54,60.45 17.92,59.83 C4.2 | C5.2 17.53,61.47 18.29,61.47 18.54,61.47
  Top 0.406: v27.94,54.61 27.94,54.24 C1.2 | U4.7 v14.48,43.81 | v19.05,34.92 U4.14
  pour Bottom (isolate 0.254): 0,0 90.17,0 90.17,96.01 0,96.01 0,83.82 10.16,83.82 10.16,20.32 0,20.32
GPS_PPS  (via drill 0.5)
  Top 0.254: U1.46 43.12,73.85 43.94,74.68 v54.61,74.68
  Bottom 0.254: v54.61,74.68 54.61,21.84 56.13,20.32 J8.1
GPS_PV  (via drill 0.5)
  Top 0.254: U1.47 42.85,74.35 43.69,75.18 53.59,75.18 54.61,76.2 v55.88,76.2
  Bottom 0.254: J8.2 62.48,17.78 63.25,18.54 63.25,21.08 62.48,21.84 57.91,21.84 56.39,23.37 56.39,75.69 v55.88,76.2
IOCHRDY
  Top 0.254: U$1.A10 27.94,11.43 27.94,13.21 26.04,15.11 U5.22
IOR  (via drill 0.5)
  Top 0.254: U3.31 63.64,47.64 64.26,48.26 v64.52,48.26
  Bottom 0.254: v64.52,48.26 64.52,15.75 63.5,14.73 40.39,14.73 39.37,13.72 U$1.B14
IRQ5
  Top 0.254: U$1.B23 60.96,11.43 60.96,9.65 59.94,8.64 31.5,8.64 30.48,9.65 30.48,13.21 29.72,13.97 28.45,13.97 27.3,15.11 U5.23
ISA_IRQ
  Top 0.254: U3.40 38.57,39.84 36.83,38.1 36.83,33.78 35.81,32.77 28.96,32.77 27.3,31.11 U5.2
ISA_RST
  Top 0.254: U5.13 14.61,16.89 13.72,16 11.43,16 8.89,13.46 U$1.B2
N$1
  Top 0.254: U7.2 48.26,27.18 46.99,25.91 U6.12
N$2
  Top 0.254: U6.6 40.64,22.1 41.66,23.11 41.66,26.42 43.05,27.81 47.5,27.81 48.16,28.47 49.78,28.47 U7.1
N$3
  Top 0.254: U7.4 48.26,24.64 47.24,23.62 47.24,21.59 46.48,20.83 U6.8
N$4
  Top 0.254: U5.8 19.68,32.64 18.54,33.78 15.49,33.78 14.48,34.8 14.48,36.58 15.37,37.47 U4.12
N$5
  Top 0.254: U5.9 18.41,32.13 17.27,33.27 15.24,33.27 13.97,34.54 13.97,37.59 15.11,38.73 U4.11
N$6
  Top 0.254: U5.10 17.14,31.62 16,32.77 14.99,32.77 13.46,34.29 13.46,38.61 14.86,40.01 U4.10
N$7
  Top 0.254: U5.11 15.88,31.11 12.95,34.04 12.95,39.62 14.61,41.27 U4.9
N$8
  Top 0.254: U2.1 59.87,65.19 R2.1
N$9
  Top 0.254: U2.5 59.88,62.59 R1.2
N$10  (1 unrouted)
N$11
  Top 0.254: U5.4 24.77,35.43 25.53,36.2 U4.16
N$12
  Top 0.254: U5.7 20.95,36.96 24,40.01 U4.19
N$13
  Top 0.254: U5.6 22.23,36.45 24.51,38.73 U4.18
N$14
  Top 0.254: U5.5 23.5,35.94 25.02,37.47 U4.17
N$15  (1 unrouted)
N$16
  Top 0.254: U1.98 18.62,64.85 17.53,63.75 C5.1
N$17  (1 unrouted)
N$18
  Top 0.254: U1.2 23.71,63.08 24.38,63.75 35.81,63.75 36.58,62.99 55.79,62.99 R2.2
N$19
  Top 0.254: U1.3 24.21,62.82 24.64,63.25 35.56,63.25 36.32,62.48 R1.1
N$20
  Bottom 0.406: SJ1.2 7.5,92.2 U$1.GND@1
N$21
  Bottom 0.406: SJ2.2 83.9,92.2 U$1.GND@2
N$22
  Bottom 0.406: SJ3.2 5.12,5.08 U$1.GND@3
N$23
  Bottom 0.406: SJ4.2 85.08,5.08 U$1.GND@4
N$24  (1 unrouted)
PK_RST1  (via drill 0.5)
  Top 0.254: U1.17 31.21,54.9 v31.75,54.36
  Bottom 0.254: J3.2 45.47,59.94 43.43,57.91 35.05,57.91 v31.75,54.36
PK_RST2  (via drill 0.5)
  Top 0.254: U1.16 30.71,53.11 v32,52.07
  Bottom 0.254: v32,52.07 32.51,52.58 41.66,52.58 42.67,53.59 42.67,55.12 43.69,56.13 J4.2
PK_RST3  (via drill 0.5)
  Top 0.254: U1.15 30.21,51.07 v31.5,49.78
  Bottom 0.254: v31.5,49.78 32,49.28 32,34.54 33.53,33.02 J5.2
PK_RST4  (via drill 0.5)
  Top 0.254: U1.14 29.71,48.78 v30.23,48.26
  Bottom 0.254: J6.2 31.75,17.78 30.23,19.3 v30.23,48.26
RTC_SCL
  Top 0.254: U1.43 42.71,72.35 43.94,71.12 57.66,71.12 | 57.66,71.12 57.91,71.12 | 57.91,71.12 58.17,71.12 | 58.17,71.12 69.09,71.12 70.48,72.52 U8.16 | 57.91,71.12 57.91,70.87 | 57.91,70.87 57.91,69.85 R3.1 | 57.66,71.12 57.91,70.87 | 57.91,70.87 58.17,71.12
RTC_SDA
  Top 0.254: U1.44 42.97,72.85 44.2,71.63 57.66,71.63 | 57.66,71.63 57.91,71.63 | 57.91,71.63 58.17,71.63 | 58.17,71.63 68.33,71.63 69.22,72.52 U8.15 | 57.91,71.63 57.91,71.88 | 57.91,71.88 57.91,72.9 R4.2 | 57.91,71.88 57.66,71.63 | 57.91,71.88 58.17,71.63
SA10
  Top 0.254: U$1.A21 56.13,9.14 54.1,9.14 53.34,9.91 53.34,14.73 52.07,16 44.45,16 43.69,16.76 43.69,21.59 44.2,22.1 U6.9
SA11
  Top 0.254: U$1.A20 55.88,11.43 55.88,14.99 51.31,19.56 48.77,19.56 47.75,20.57 47.75,22.61 48.51,23.37 U7.5
SA12
  Top 0.254: U$1.A19 50.8,11.43 50.8,14.48 49.78,15.49 44.2,15.49 43.18,16.51 43.18,22.61 43.94,23.37 U6.10
SA13
  Top 0.254: U$1.A18 48.26,11.43 48.26,13.97 47.24,14.99 43.94,14.99 42.67,16.26 42.67,23.62 43.69,24.64 U6.11
SA14
  Top 0.254: U$1.A17 45.72,11.43 45.72,13.72 44.96,14.48 43.69,14.48 42.16,16 42.16,26.16 43.18,27.18 U6.13
SA15
  Top 0.254: U$1.A16 43.18,11.43 43.18,13.72 42.42,14.48 38.61,14.48 37.08,16 37.08,22.61 37.85,23.37 U6.5
SA16
  Top 0.254: U$1.A15 40.64,11.43 40.64,13.46 40.13,13.97 38.35,13.97 36.58,15.75 36.58,23.62 37.59,24.64 U6.4
SA17
  Top 0.254: U$1.A14 38.1,11.43 38.1,13.46 36.07,15.49 36.07,24.64 37.34,25.91 U6.3
SA18
  Top 0.254: U$1.A13 35.56,11.43 35.56,25.4 37.34,27.18 U6.2
SA19
  Top 0.254: U$1.A12 33.02,11.43 33.02,13.46 35.05,15.49 35.05,26.42 37.08,28.45 U6.1
SD0
  Top 0.254: U$1.A9 25.4,11.43 25.4,13.21 24.77,13.84 U5.21
SD1
  Top 0.254: U$1.A8 22.86,11.43 22.86,13.21 23.5,13.84 U5.20
SD2
  Top 0.254: U$1.A7 20.32,11.43 20.32,13.21 22.23,15.11 U5.19
SD3
  Top 0.254: U$1.A6 17.78,11.43 17.78,13.21 18.54,13.97 19.81,13.97 20.95,15.11 U5.18
SD4
  Top 0.254: U$1.A5 15.24,11.43 15.24,13.21 16,13.97 17.78,13.97 19.68,15.88 U5.17
SD5
  Top 0.254: U$1.A4 12.7,11.43 12.7,13.21 13.97,14.48 17.02,14.48 18.41,15.88 U5.16
SD6
  Top 0.254: U$1.A3 10.41,11.18 10.41,13.46 11.94,14.99 16.26,14.99 17.14,15.88 U5.15
SD7
  Top 0.254: U$1.A2 9.91,11.18 9.91,13.72 11.68,15.49 14.99,15.49 15.88,16.38 U5.14
VCC  (2 unrouted)

### Text on the board
Document: University of Minnesota HASP / Photon Timing and Preprocessor Board | 2015 Rev 1.0